# Altium project STM32F746 DEV BOARD_V1I1.PrjPcb (part 1 of 2)
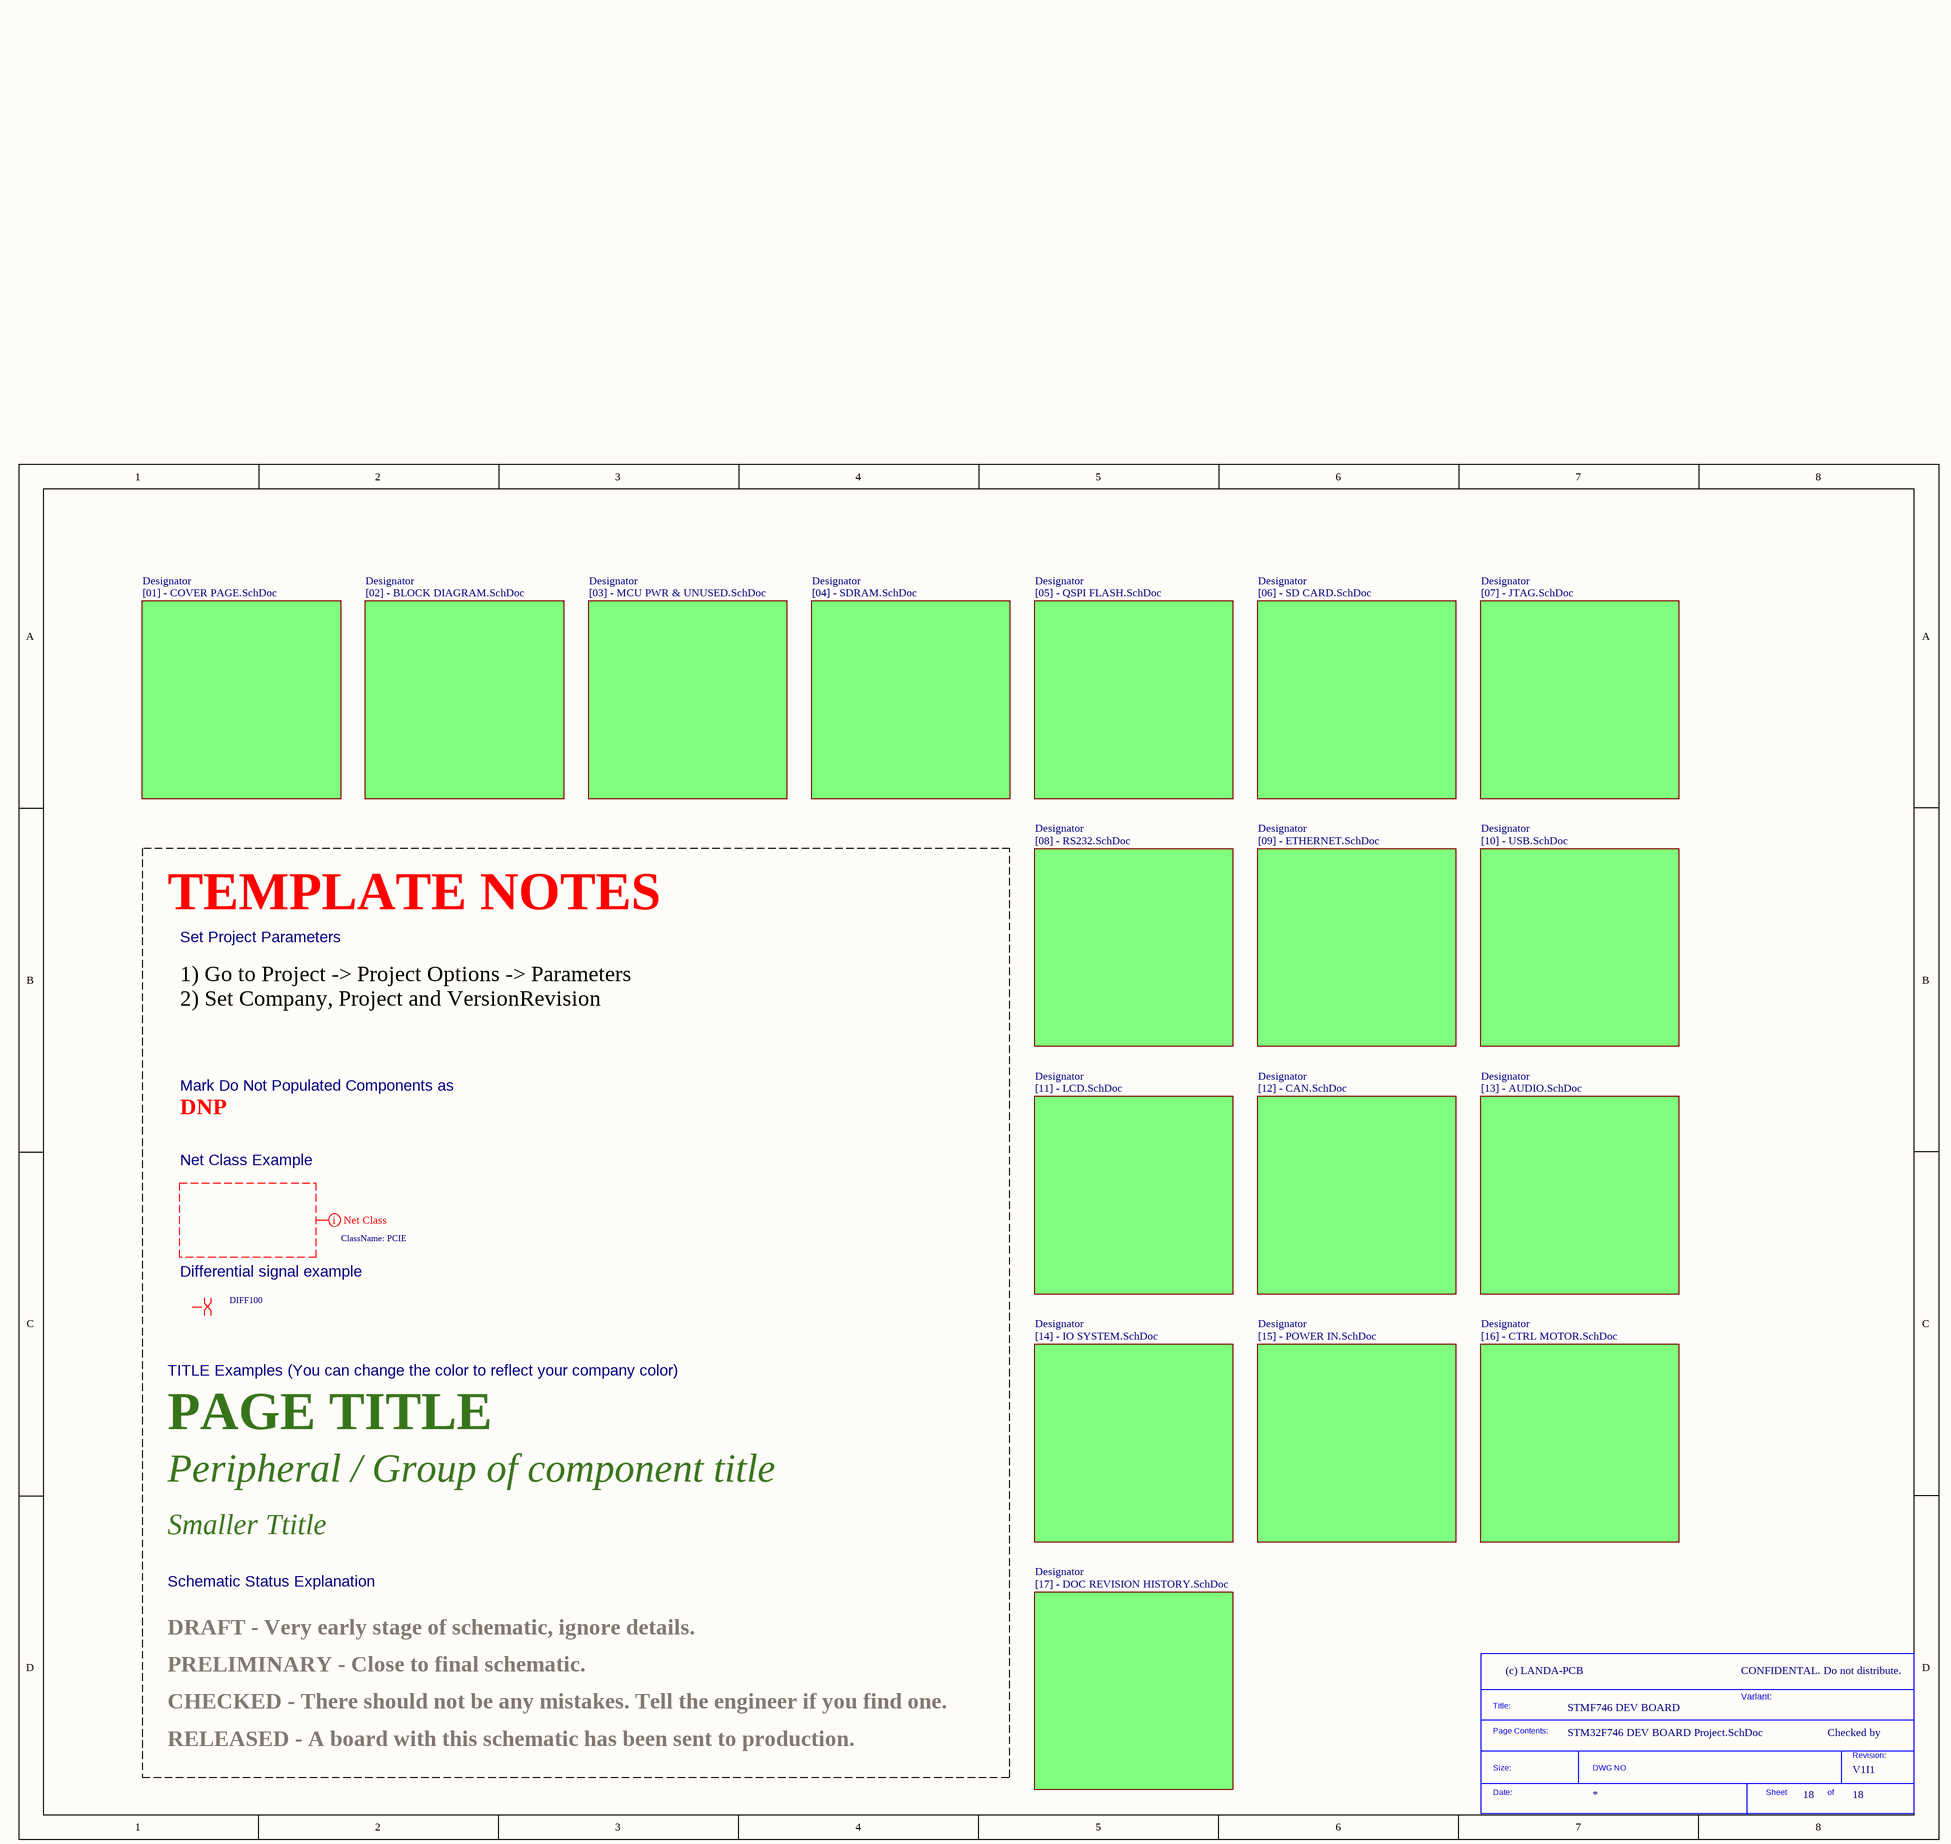
[diagram p0: STM32F746 DEV BOARD Project.SchDoc]
Company: (c) LANDA-PCB; Project: STMF746 DEV BOARD; VersionRevision: V1I1
18 sheets, 372 parts. Net scope: flat (ports and power ports of the same name join across sheets).
Sheets:
  STM32F746 DEV BOARD Project.SchDoc
    Designator = [01] - COVER PAGE.SchDoc
    Designator = [02] - BLOCK DIAGRAM.SchDoc
    Designator = [17] - DOC REVISION HISTORY.SchDoc
    Designator = [03] - MCU PWR & UNUSED.SchDoc
    Designator = [04] - SDRAM.SchDoc
    Designator = [05] - QSPI FLASH.SchDoc
    Designator = [06] - SD CARD.SchDoc
    Designator = [16] - CTRL MOTOR.SchDoc
    Designator = [07] - JTAG.SchDoc
    Designator = [08] - RS232.SchDoc
    Designator = [09] - ETHERNET.SchDoc
    Designator = [10] - USB.SchDoc
    Designator = [11] - LCD.SchDoc
    Designator = [12] - CAN.SchDoc
    Designator = [13] - AUDIO.SchDoc
    Designator = [14] - IO SYSTEM.SchDoc
    Designator = [15] - POWER IN.SchDoc

## Sheet STM32F746 DEV BOARD Project.SchDoc
size A3; CompanyName: KDS; Organization: KDS; DocumentNumber: 18; Revision: V1I1; SheetNumber: 18; SheetTotal: 18; PageSetup: Record=PageOptions|CenterHorizontal=True|CenterVertical=True|PrintScale=1.07|XCorrection=1.00|YCorrection=1.00|PrintKind=1|BorderSize=5000000|LeftOffset=0|BottomOffset=0|Orientation=2|PaperLength=1000|PaperWidth=1000|Scale=100|PaperSource=7|PrintQuality=600|MediaType=1|DitherType=10|PaperKind=A3|PrintScaleMode=1; ProjectName: KDS C6A816x Module

### Parts
(Parts that share a designator on the sheet are numbered #1, #2 ... from top to bottom, then left to right.)
*#1  SDTitleBlock  (value not drawn)  (graphical)

### Sub-sheets
Designator = [01] - COVER PAGE.SchDoc: no entries
Designator = [02] - BLOCK DIAGRAM.SchDoc: no entries
Designator = [17] - DOC REVISION HISTORY.SchDoc: no entries
Designator = [03] - MCU PWR & UNUSED.SchDoc: no entries
Designator = [04] - SDRAM.SchDoc: no entries
Designator = [05] - QSPI FLASH.SchDoc: no entries
Designator = [06] - SD CARD.SchDoc: no entries
Designator = [16] - CTRL MOTOR.SchDoc: no entries
Designator = [07] - JTAG.SchDoc: no entries
Designator = [08] - RS232.SchDoc: no entries
Designator = [09] - ETHERNET.SchDoc: no entries
Designator = [10] - USB.SchDoc: no entries
Designator = [11] - LCD.SchDoc: no entries
Designator = [12] - CAN.SchDoc: no entries
Designator = [13] - AUDIO.SchDoc: no entries
Designator = [14] - IO SYSTEM.SchDoc: no entries
Designator = [15] - POWER IN.SchDoc: no entries

### Layout directives
net class PCIE: (no net found under the mark)
differential pair; net class DIFF100: (no net found under the mark)

### Notes on the sheet
- TEMPLATE NOTES
- Set Project Parameters
- 1) Go to Project -> Project Options -> Parameters
  2) Set Company, Project and VersionRevision
- DNP
- Mark Do Not Populated Components as
- Net Class Example
- Differential signal example
- TITLE Examples (You can change the color to reflect your company color)
- PAGE TITLE
- Peripheral / Group of component title
- Smaller Ttitle
- Schematic Status Explanation
- PRELIMINARY - Close to final schematic.
- DRAFT - Very early stage of schematic, ignore details.
- CONFIDENTAL. Do not distribute.
- CHECKED - There should not be any mistakes. Tell the engineer if you find one.
- Variant:
- Checked by
- RELEASED - A board with this schematic has been sent to production.
- (in symbol SDTitleBlock) Title:; Page Contents:; Revision:; Size:; DWG NO; Date:; Sheet; of

## Sheet [01] - COVER PAGE.SchDoc
size A3; DocumentNumber: 1; SheetNumber: 1; SheetTotal: 18
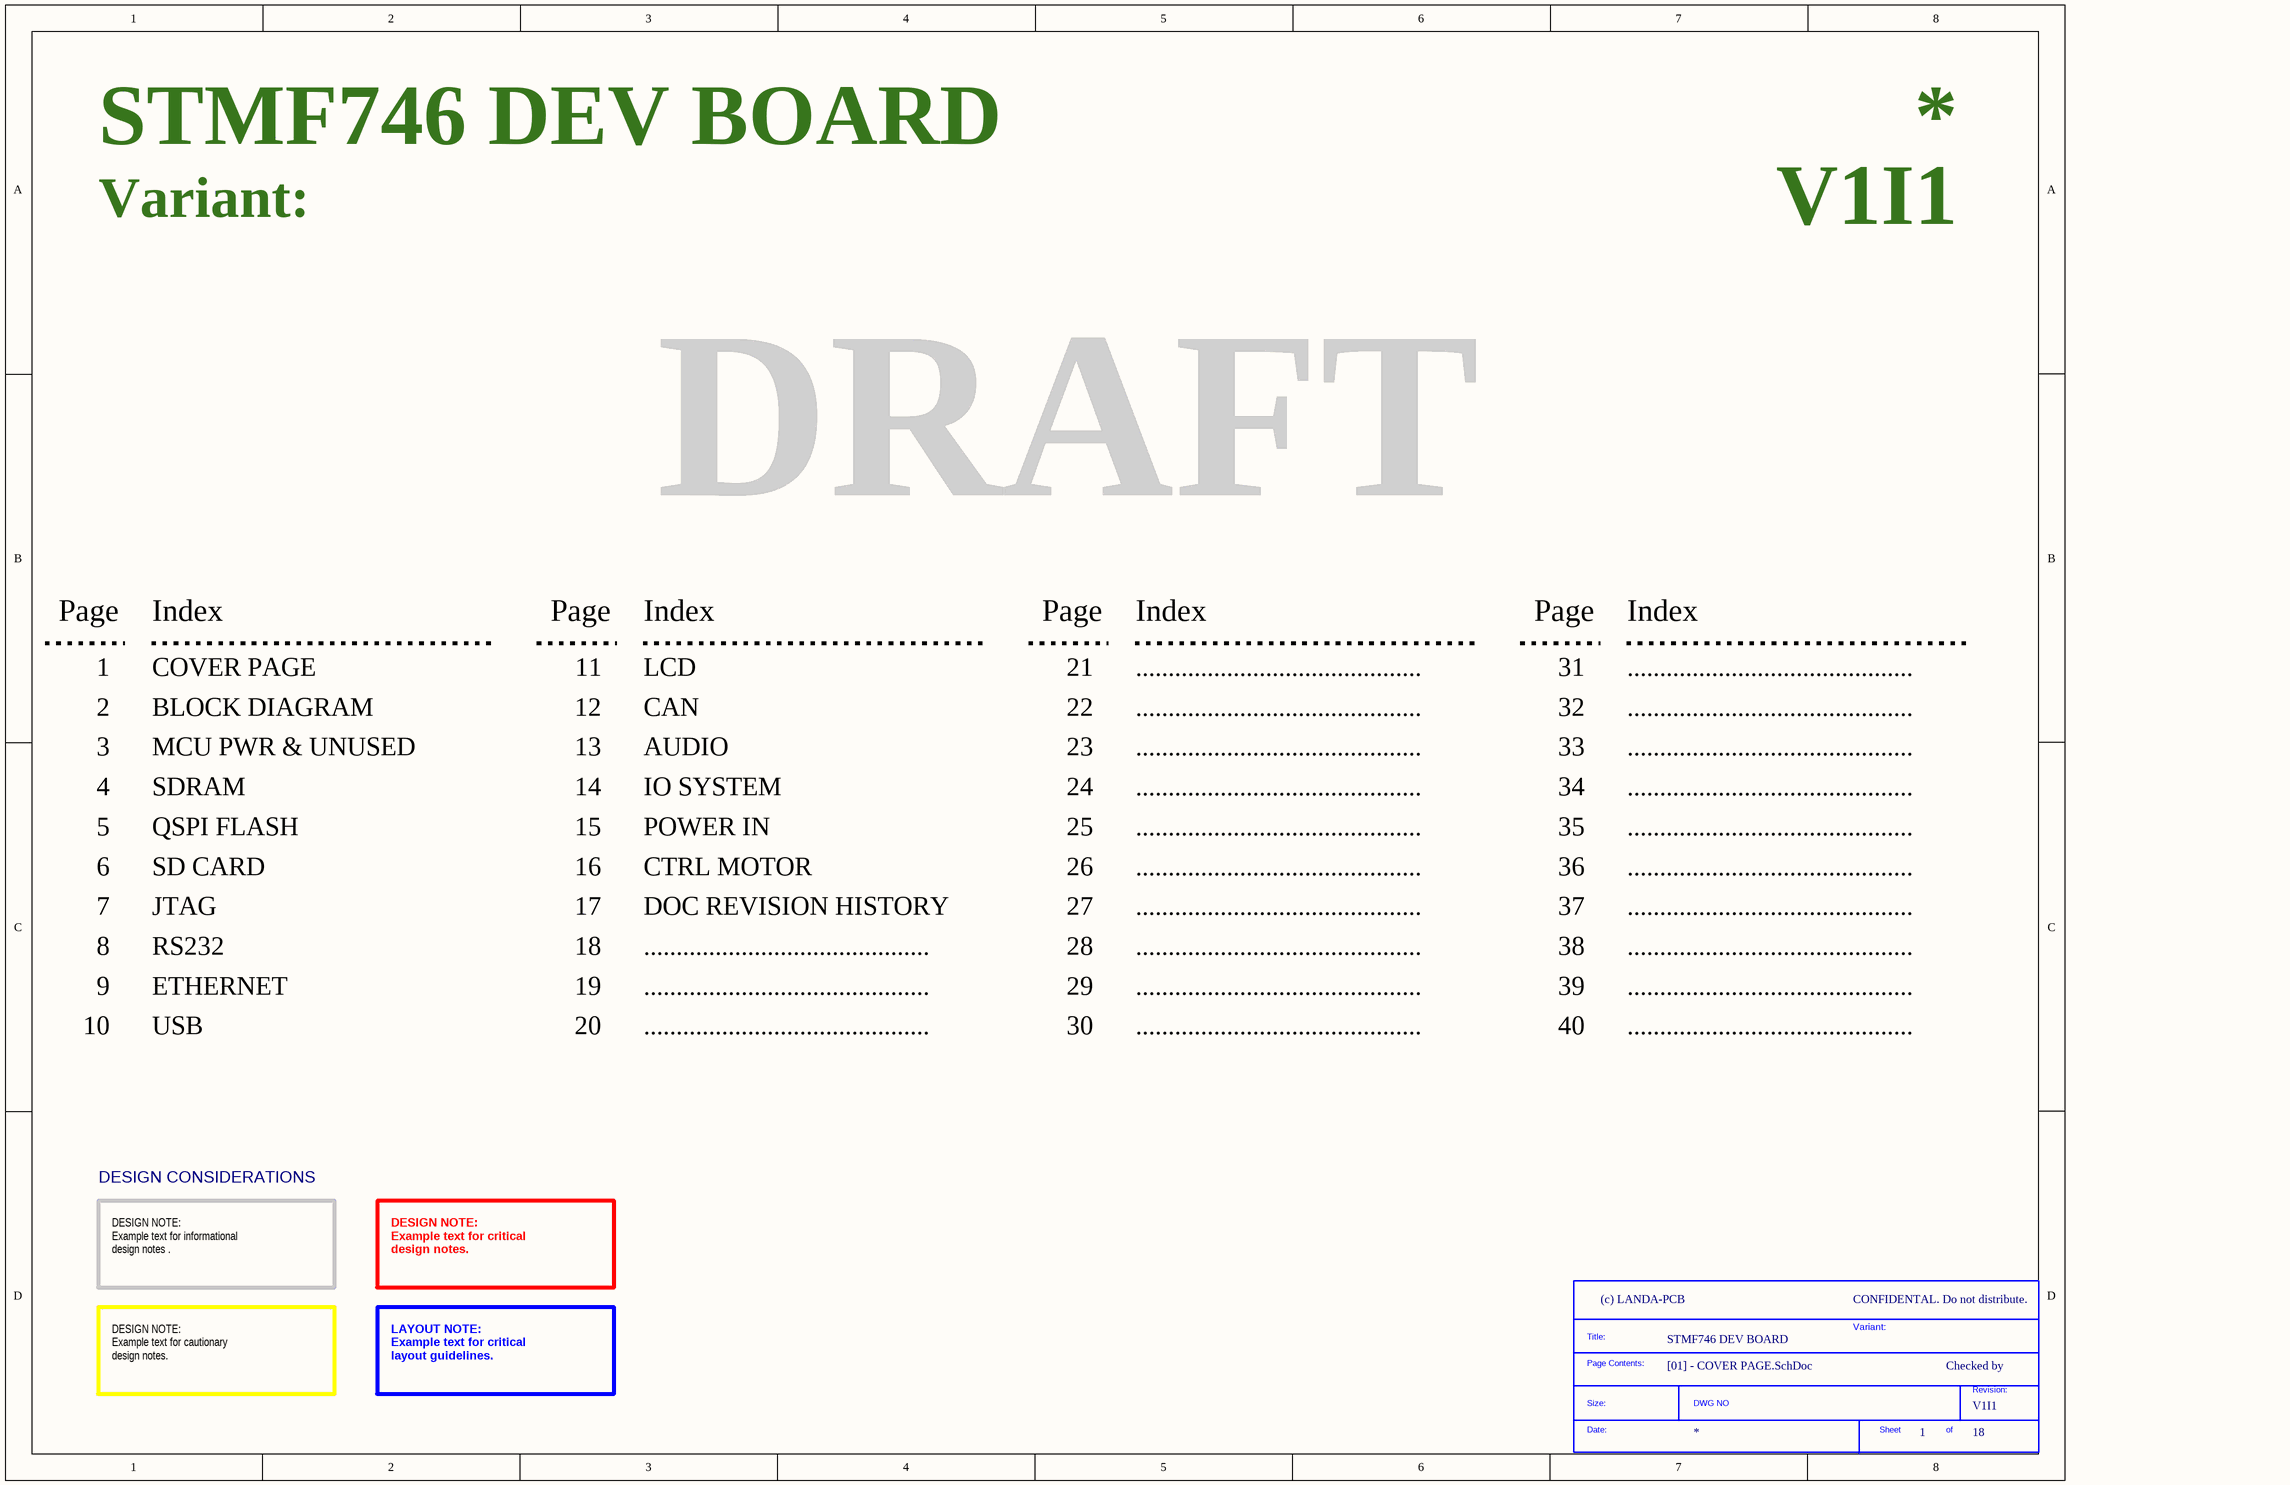
[diagram p1: [01] - COVER PAGE.SchDoc]

### Parts
(Parts that share a designator on the sheet are numbered #1, #2 ... from top to bottom, then left to right.)
*#2  SDTitleBlock  (value not drawn)  (graphical)

### Notes on the sheet
- Variant:
- DRAFT
- Page
- Index
- 1
- COVER PAGE
- 11
- LCD
- 21
- ............................................
- 31
- 2
- 3
- BLOCK DIAGRAM
- MCU PWR & UNUSED
- 12
- 13
- CAN
- AUDIO
- 22
- 23
- 32
- 33
- 4
- 5
- SDRAM
- QSPI FLASH
- 14
- 15
- IO SYSTEM
- POWER IN
- 24
- 25
- 34
- 35
- 6
- SD CARD
- 16
- CTRL MOTOR
- 26
- 36
- 7
- 8
- JTAG
- RS232
- 17
- 18
- DOC REVISION HISTORY
- 27
- 28
- 37
- 38
- 9
- 10
- ETHERNET
- USB
- 19
- 20
- 29
- 30
- 39
- 40
- DESIGN CONSIDERATIONS
- DESIGN NOTE:
  Example text for informational
  design notes .
- DESIGN NOTE:
  Example text for critical
  design notes.
- CONFIDENTAL. Do not distribute.
- Checked by
- DESIGN NOTE:
  Example text for cautionary
  design notes.
- LAYOUT NOTE:
  Example text for critical
  layout guidelines.
- (in symbol SDTitleBlock) Title:; Page Contents:; Revision:; Size:; DWG NO; Date:; Sheet; of

## Sheet [02] - BLOCK DIAGRAM.SchDoc
size A3; DocumentNumber: 2; SheetNumber: 2; SheetTotal: 18
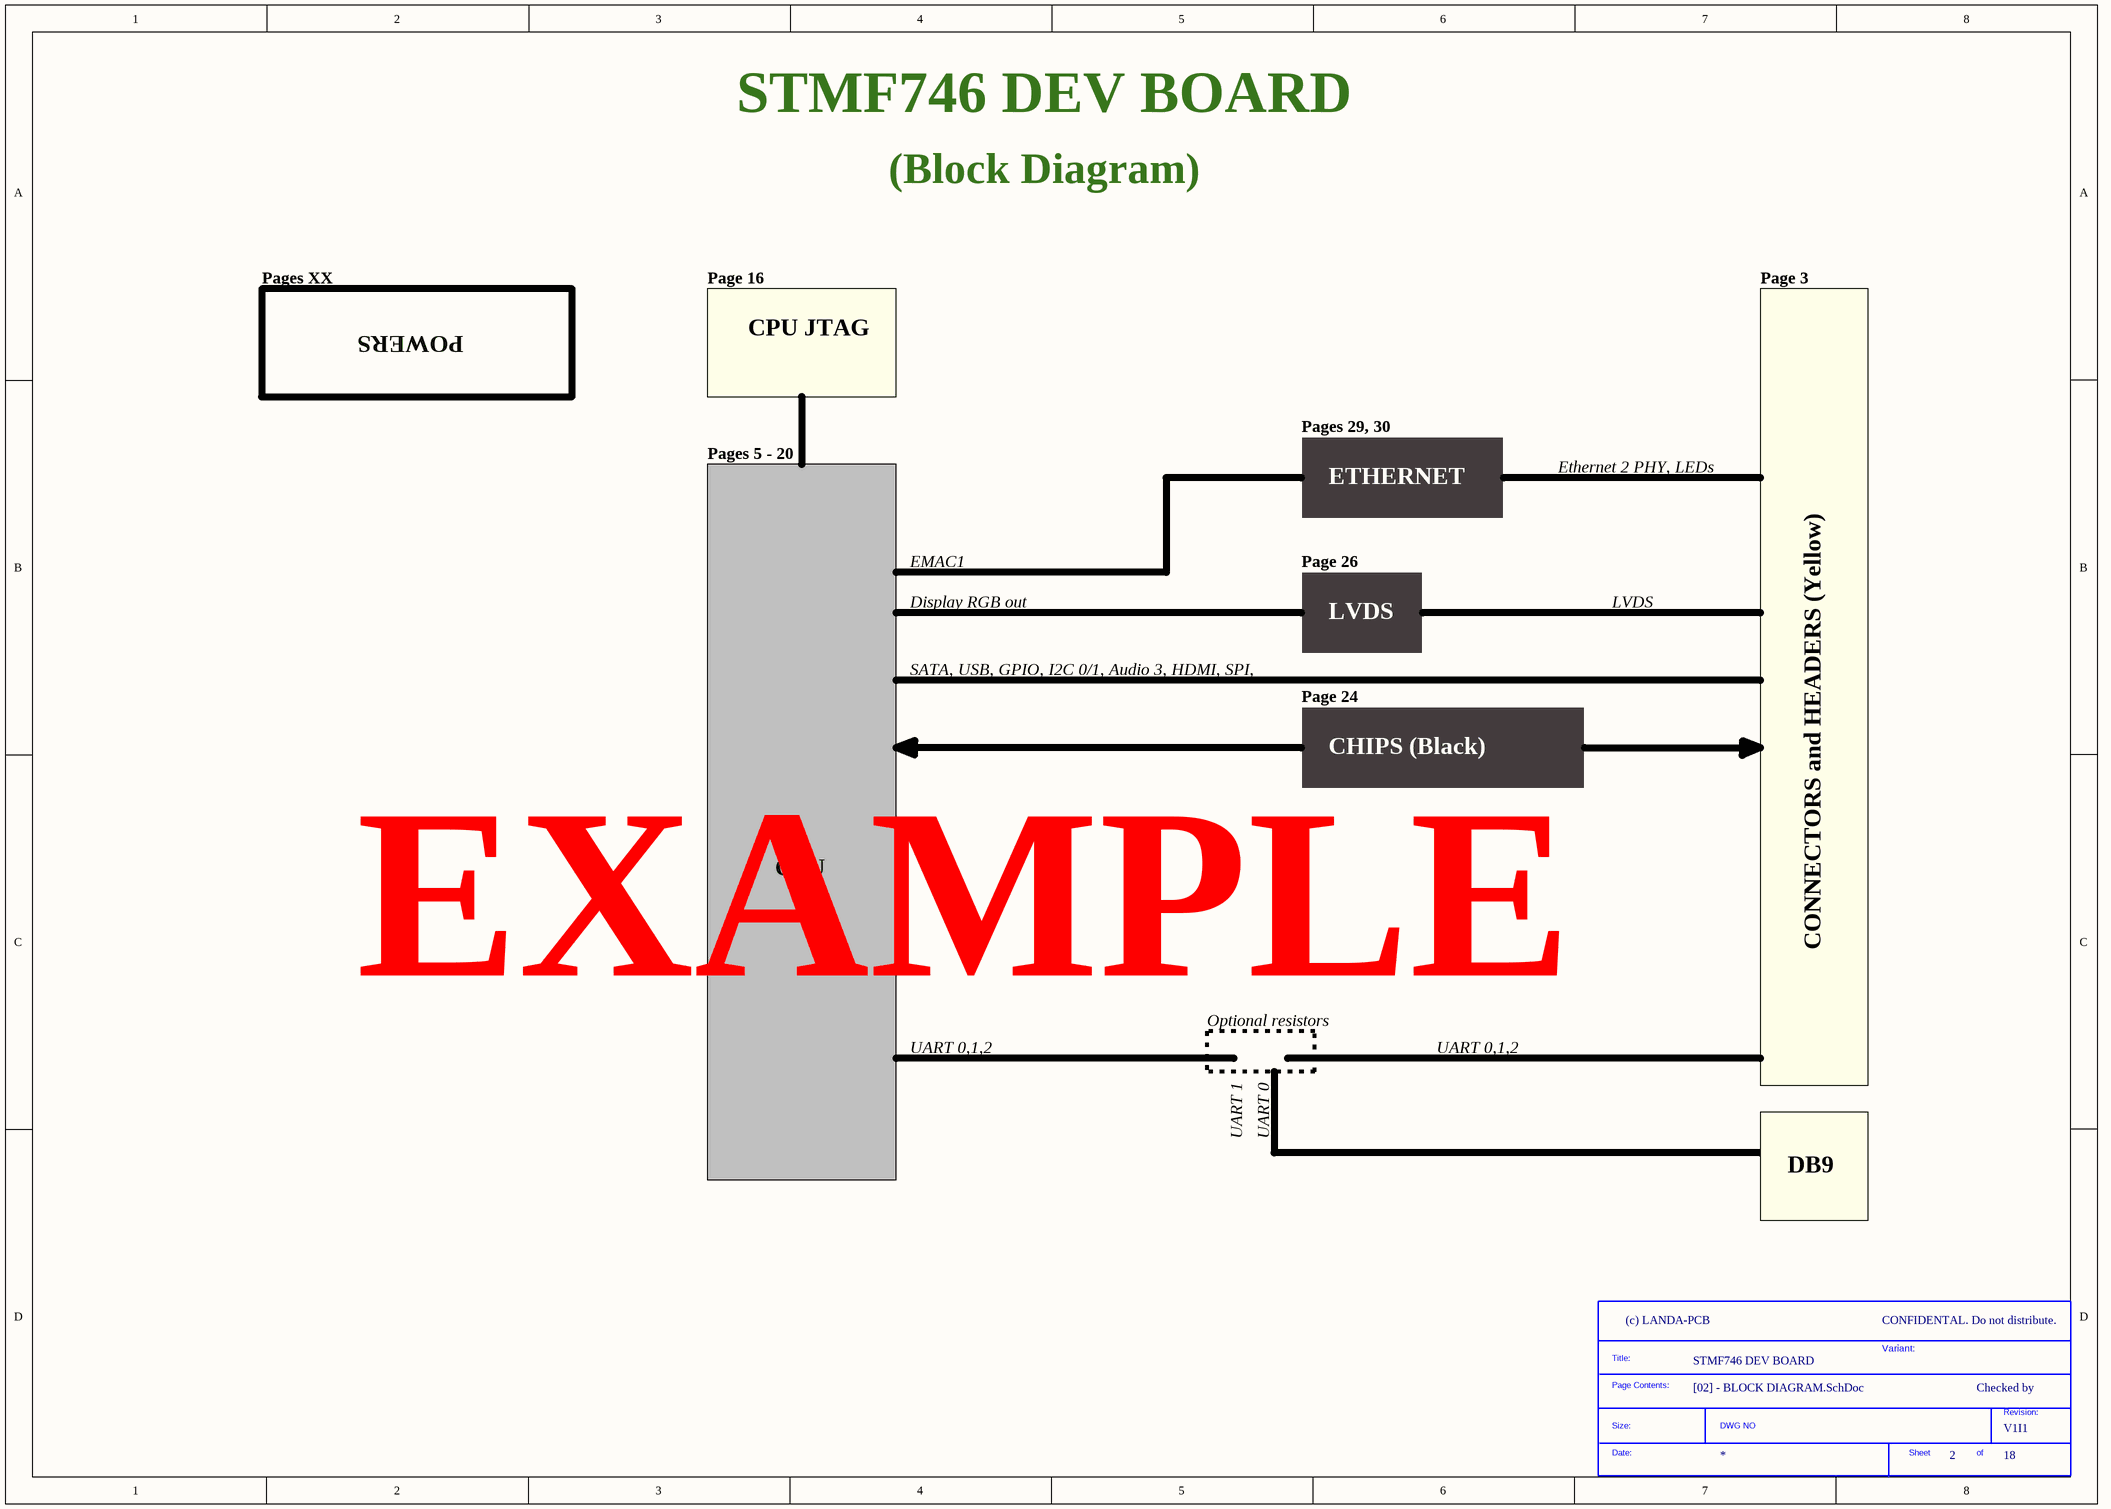
[diagram p2: [02] - BLOCK DIAGRAM.SchDoc]

### Parts
(Parts that share a designator on the sheet are numbered #1, #2 ... from top to bottom, then left to right.)
*#3  SDTitleBlock  (value not drawn)  (graphical)

### Notes on the sheet
- (Block Diagram)
- Pages XX
- Page 16
- Page 3
- POWERS
- CPU JTAG
- Pages 29, 30
- Pages 5 - 20
- ETHERNET
- Ethernet 2 PHY, LEDs
- EMAC1
- Page 26
- Display RGB out
- LVDS
- SATA, USB, GPIO, I2C 0/1, Audio 3, HDMI, SPI,
- Page 24
- CHIPS (Black)
- CPU
- CONNECTORS and HEADERS (Yellow)
- EXAMPLE
- UART 0,1,2
- Optional resistors
- FPGA
- UART 1
- UART 0
- DB9
- CONFIDENTAL. Do not distribute.
- CLOCKS (CPU & PCIE)
- Variant:
- Checked by
- (in symbol SDTitleBlock) Title:; Page Contents:; Revision:; Size:; DWG NO; Date:; Sheet; of

## Sheet [17] - DOC REVISION HISTORY.SchDoc
size A3; DocumentNumber: 17; SheetNumber: 17; SheetTotal: 18
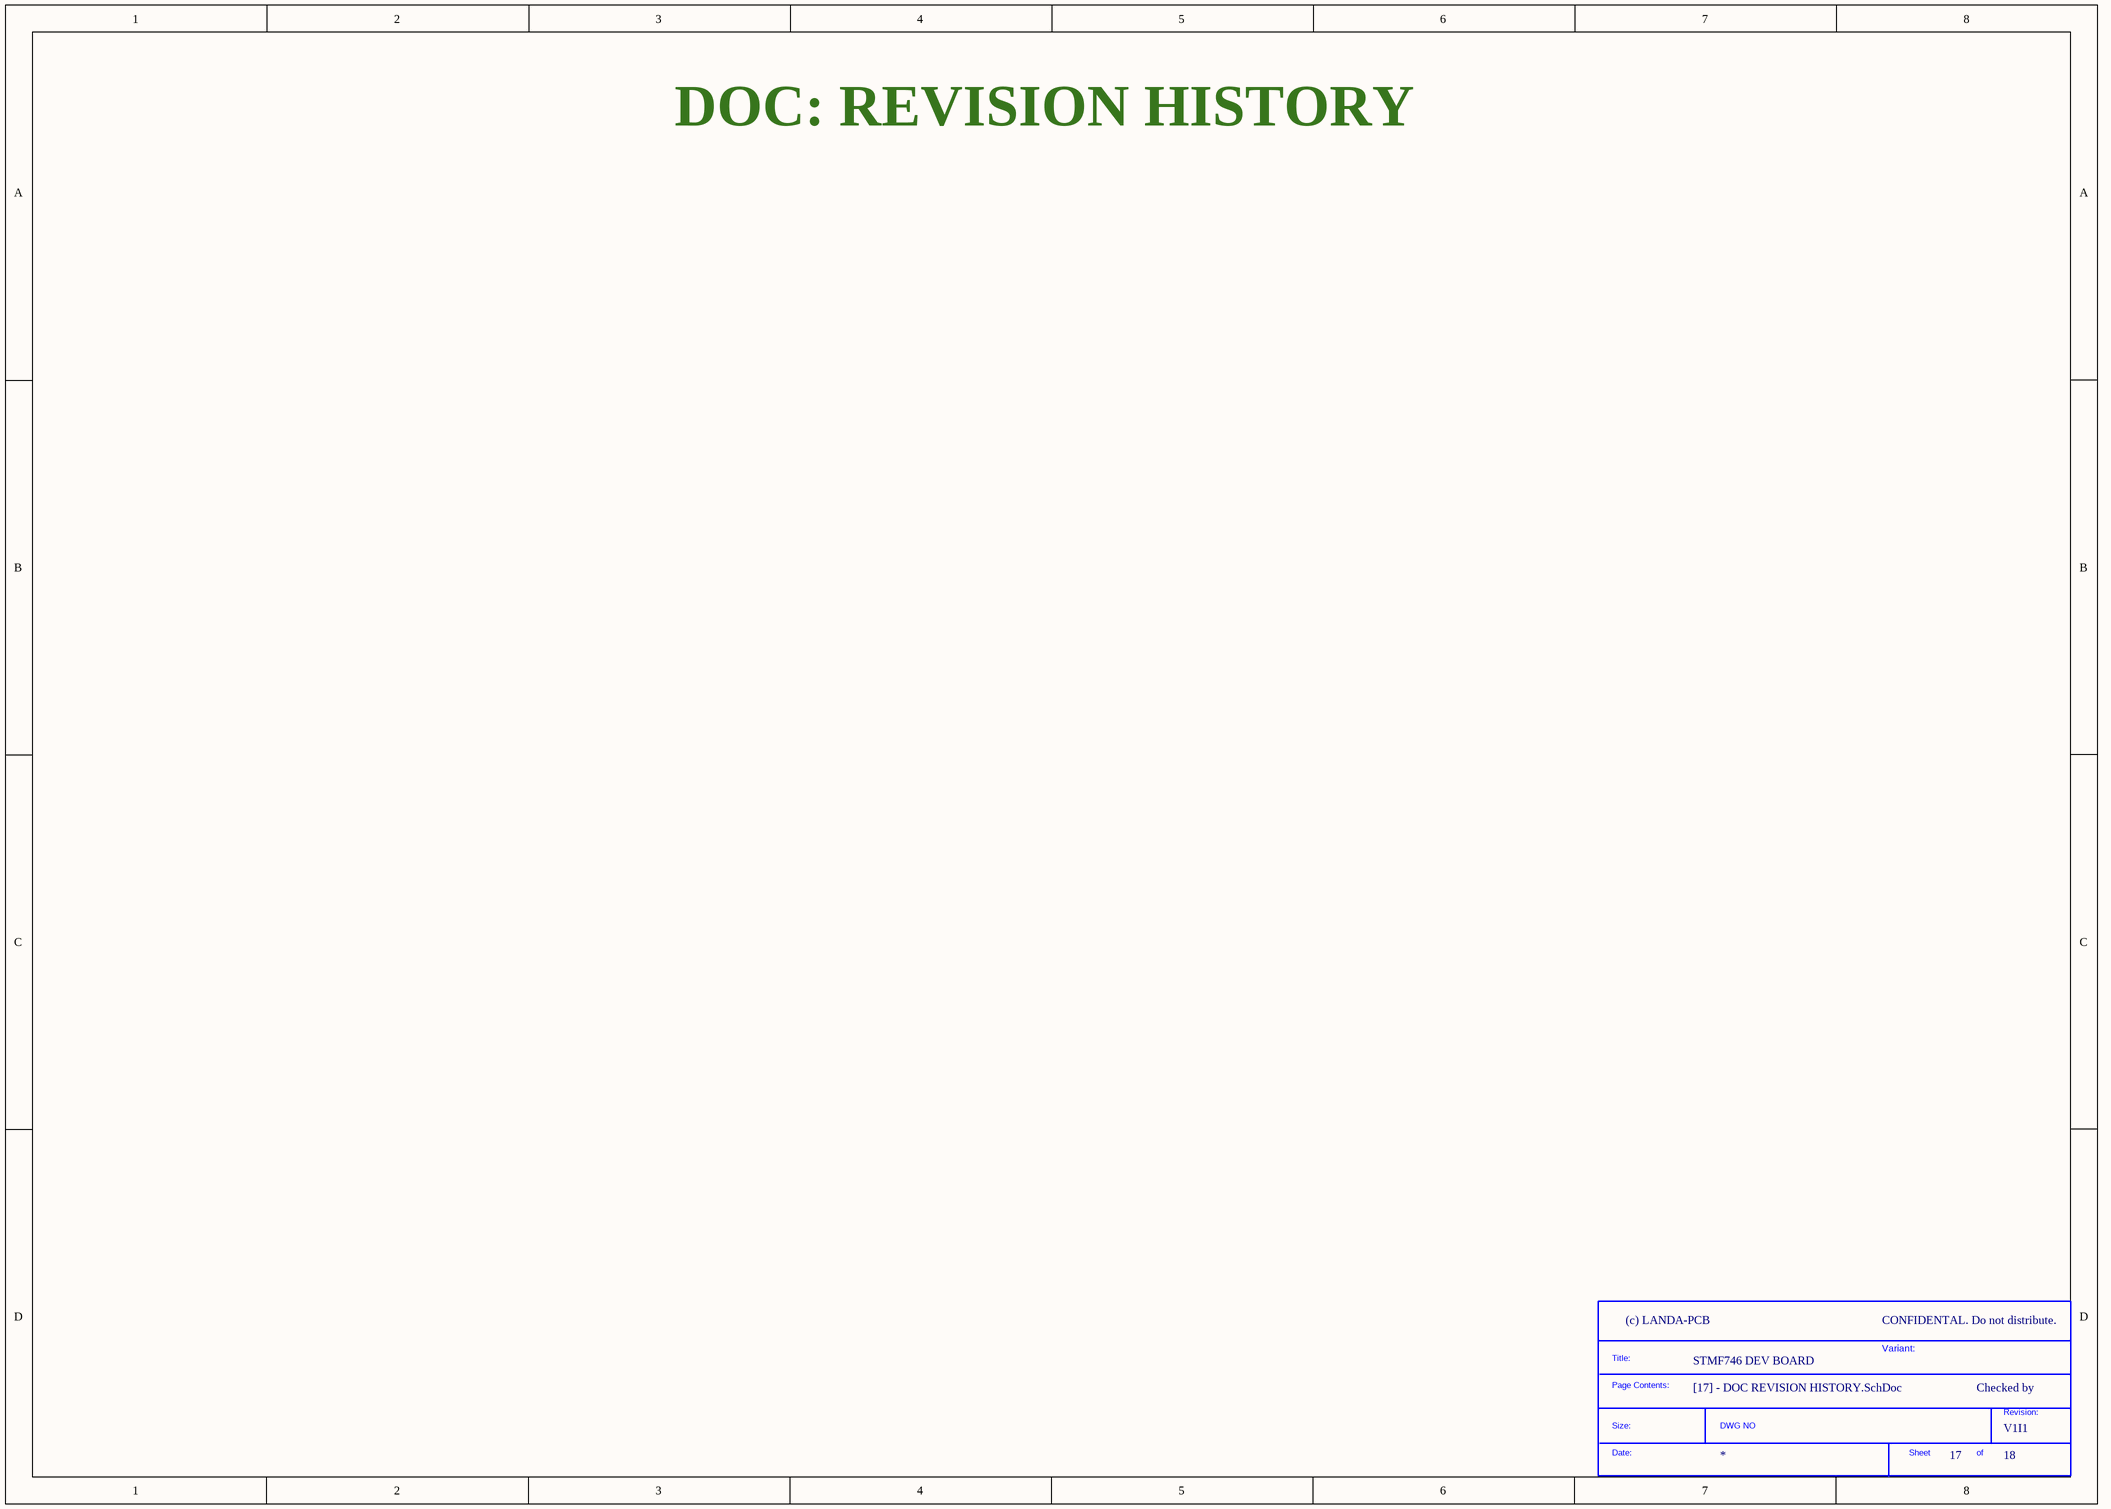
[diagram p3: [17] - DOC REVISION HISTORY.SchDoc]

### Parts
(Parts that share a designator on the sheet are numbered #1, #2 ... from top to bottom, then left to right.)
*#4  SDTitleBlock  (value not drawn)  (graphical)

### Notes on the sheet
- DOC: REVISION HISTORY
- CONFIDENTAL. Do not distribute.
- CLOCKS (CPU & PCIE)
- Variant:
- Checked by
- (in symbol SDTitleBlock) Title:; Page Contents:; Revision:; Size:; DWG NO; Date:; Sheet; of

## Sheet [03] - MCU PWR & UNUSED.SchDoc
size A3; DocumentNumber: 3; SheetNumber: 3; SheetTotal: 18
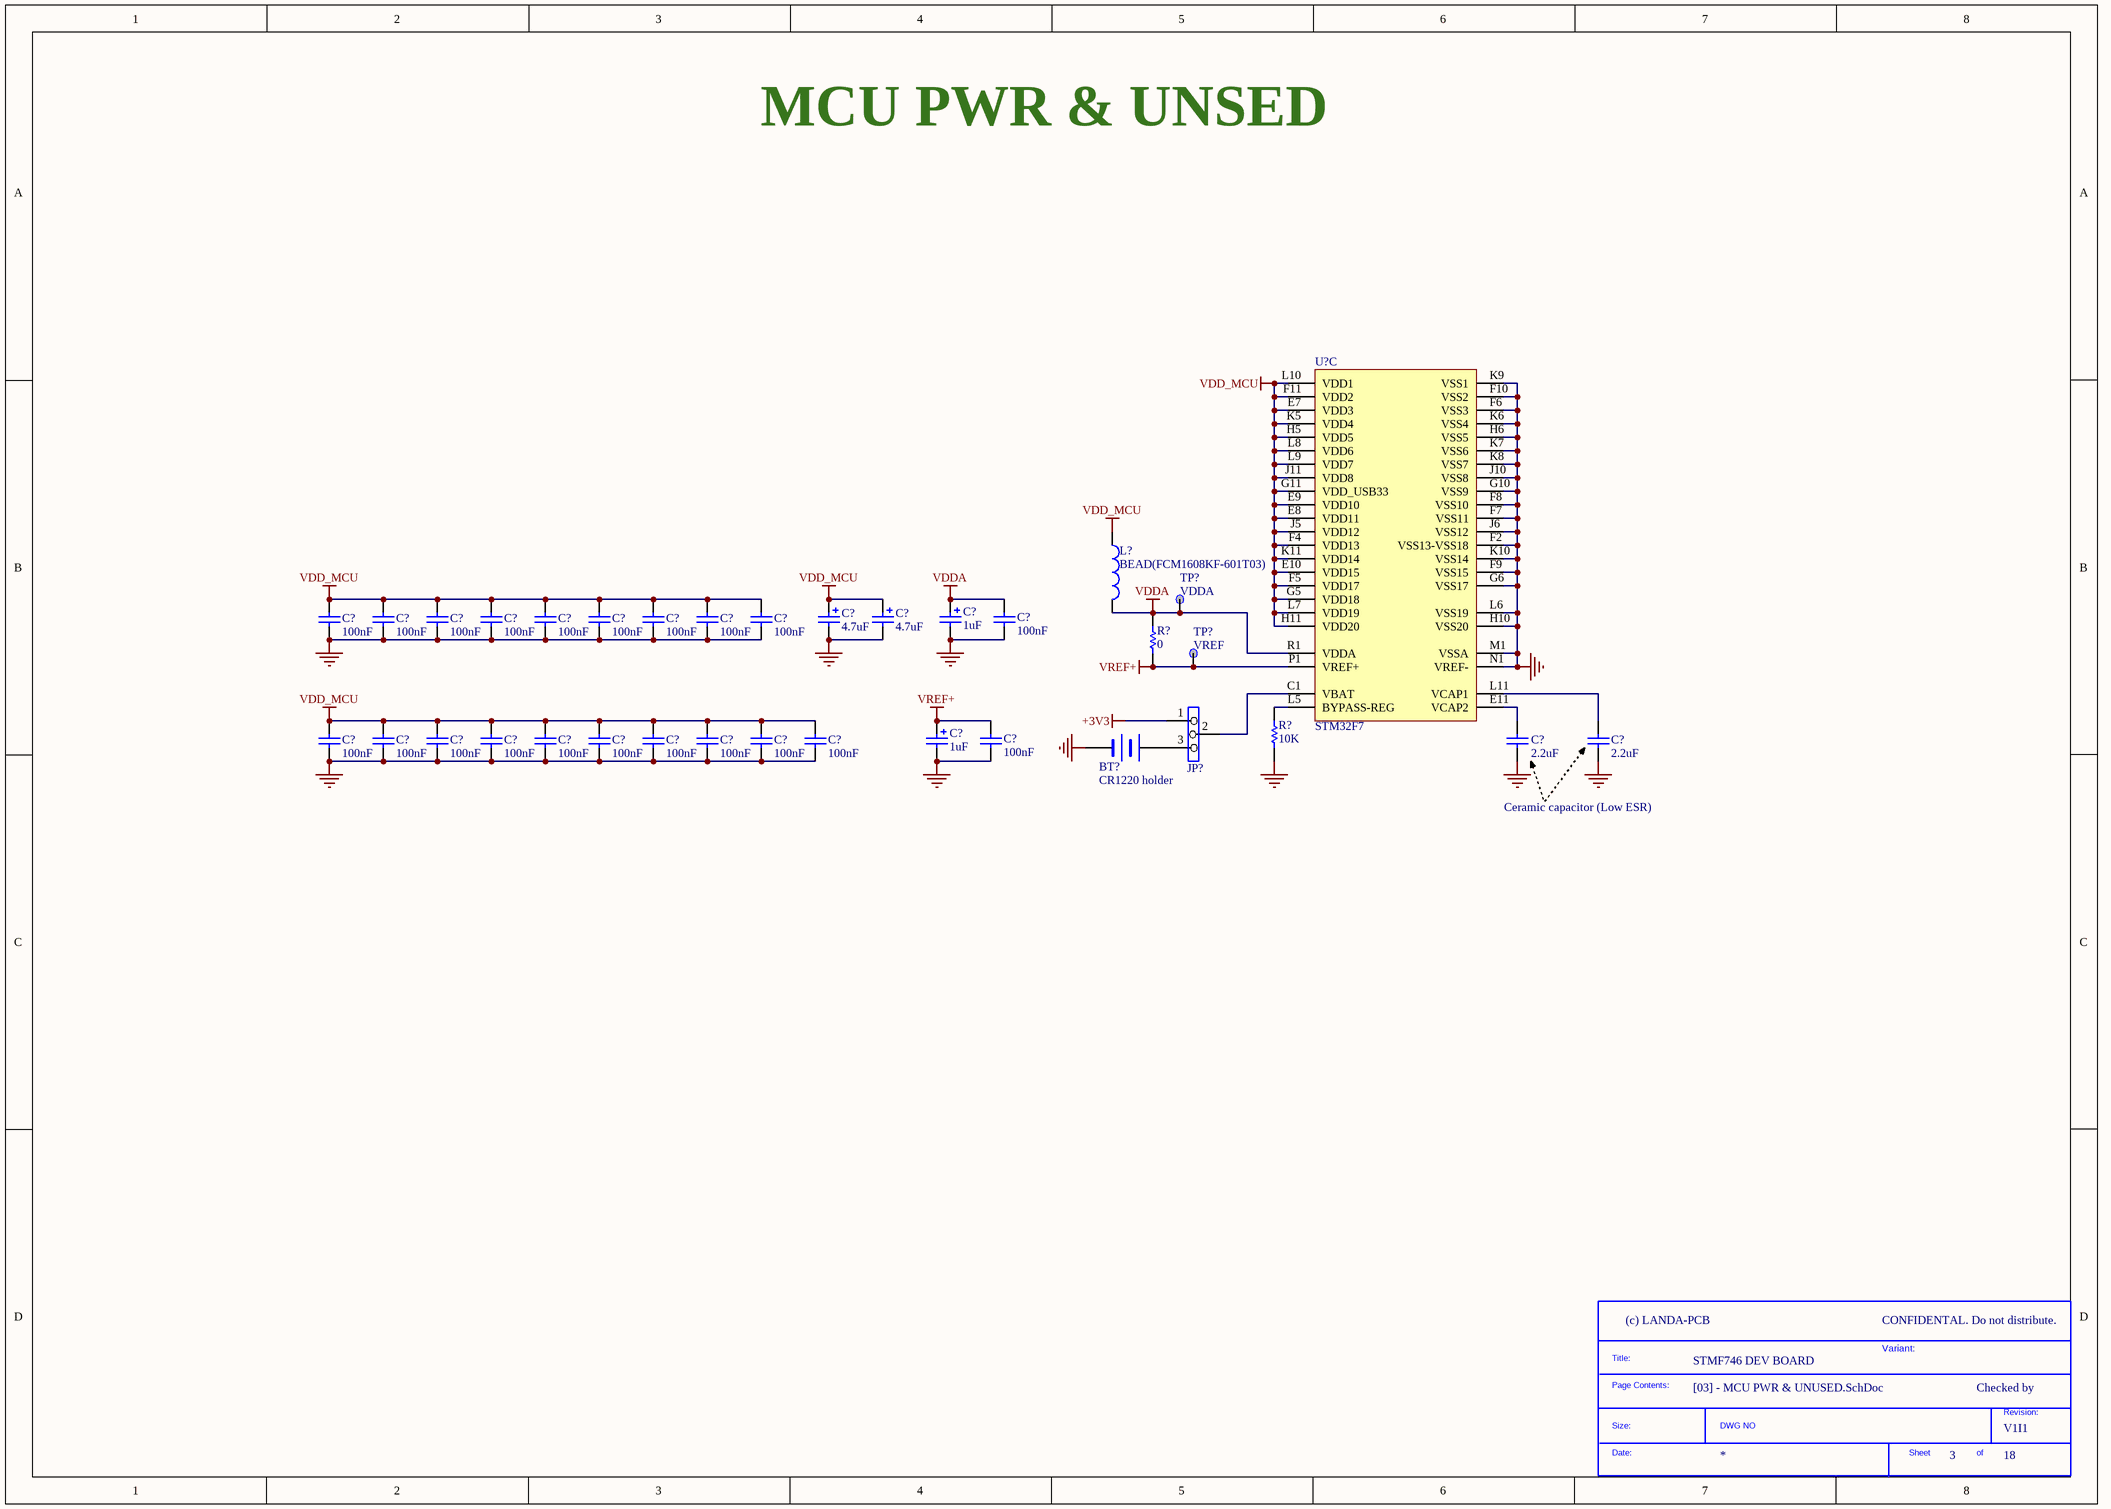
[diagram p4: [03] - MCU PWR & UNUSED.SchDoc]

### Parts
(Parts that share a designator on the sheet are numbered #1, #2 ... from top to bottom, then left to right.)
*#5  SDTitleBlock  (value not drawn)  (graphical)
BT?  CR1220 holder  [BAT_2SM_CR1220]
C?#1  100nF  [0402C]
C?#2  100nF  [0402C]
C?#3  100nF  [0402C]
C?#4  100nF  [0402C]
C?#5  100nF  [0402C]
C?#6  100nF  [0402C]
C?#7  100nF  [0402C]
C?#8  100nF  [0402C]
C?#9  100nF  [0402C]
C?#10  4.7uF  [TAN-A]
C?#11  4.7uF  [TAN-A]
C?#12  1uF  [TAN-A]
C?#13  100nF  [0402C]
C?#14  100nF  [0402C]
C?#15  100nF  [0402C]
C?#16  100nF  [0402C]
C?#17  100nF  [0402C]
C?#18  100nF  [0402C]
C?#19  100nF  [0402C]
C?#20  100nF  [0402C]
C?#21  100nF  [0402C]
C?#22  100nF  [0402C]
C?#23  100nF  [0402C]
C?#24  1uF  [TAN-A]
C?#25  2.2uF  [1206C]
C?#26  2.2uF  [1206C]
C?#27  100nF  [0402C]
JP?#1  (no value)  [SIP3]
L?#1  BEAD(FCM1608KF-601T03)  [0603L]
R?#1  0  [0603R]
R?#2  10K  [0603R]
TP?#1  VDDA  [TP]
TP?#2  VREF  [TP]
U?#1  STM32F7  [BGA216_0R8_13X13_SKT]  (part C of 3)

### Nets
+3V3: JP?#1.1
GND: BT?.2(-) C?#1.2 C?#2.2 C?#3.2 C?#4.2 C?#5.2 C?#6.2 C?#7.2 C?#8.2 C?#9.2 C?#10.2 C?#11.2 C?#12.2 C?#13.1 C?#14.2 C?#15.2 C?#16.2 C?#17.2 C?#18.2 C?#19.2 C?#20.2 C?#21.2 C?#22.2 C?#23.2 C?#24.2 C?#25.2 C?#26.2 C?#27.1 R?#2.1 U?#1.F2(VSS13-VSS18) U?#1.F6(VSS3) U?#1.F7(VSS11) U?#1.F8(VSS10) U?#1.F9(VSS15) U?#1.F10(VSS2) U?#1.G6(VSS17) U?#1.G10(VSS9) U?#1.H6(VSS5) U?#1.H10(VSS20) U?#1.J6(VSS12) U?#1.J10(VSS8) U?#1.K6(VSS4) U?#1.K7(VSS6) U?#1.K8(VSS7) U?#1.K9(VSS1) U?#1.K10(VSS14) U?#1.L6(VSS19) U?#1.M1(VSSA) U?#1.N1(VREF-)
VDD_MCU: C?#1.1 C?#2.1 C?#3.1 C?#4.1 C?#5.1 C?#6.1 C?#7.1 C?#8.1 C?#9.1 C?#10.1 C?#11.1 C?#14.1 C?#15.1 C?#16.1 C?#17.1 C?#18.1 C?#19.1 C?#20.1 C?#21.1 C?#22.1 C?#23.1 L?#1.1 U?#1.E7(VDD3) U?#1.E8(VDD11) U?#1.E9(VDD10) U?#1.E10(VDD15) U?#1.F4(VDD13) U?#1.F5(VDD17) U?#1.F11(VDD2) U?#1.G5(VDD18) U?#1.G11(VDD_USB33) U?#1.H5(VDD5) U?#1.H11(VDD20) U?#1.J5(VDD12) U?#1.J11(VDD8) U?#1.K5(VDD4) U?#1.K11(VDD14) U?#1.L7(VDD19) U?#1.L8(VDD6) U?#1.L9(VDD7) U?#1.L10(VDD1)
VDDA: C?#12.1 C?#13.2 L?#1.2 R?#1.1 TP?#1.1 U?#1.R1(VDDA)
VREF+: C?#24.1 C?#27.2 R?#1.2 TP?#2.1 U?#1.P1(VREF+)
NetBT?_1: BT?.1(+) JP?#1.3
NetC?#25_1: C?#25.1 U?#1.E11(VCAP2)
NetC?#26_1: C?#26.1 U?#1.L11(VCAP1)
NetJP?#1_2: JP?#1.2 U?#1.C1(VBAT)
NetR?#2_2: R?#2.2 U?#1.L5(BYPASS-REG)

### Notes on the sheet
- MCU PWR & UNSED
- Ceramic capacitor (Low ESR)
- CONFIDENTAL. Do not distribute.
- CLOCKS (CPU & PCIE)
- Variant:
- Checked by
- (in symbol SDTitleBlock) Title:; Page Contents:; Revision:; Size:; DWG NO; Date:; Sheet; of

### Library data of the parts
BT? = BATTERY
C?#1-C?#9 C?#14-C?#23 = CAP: Capacitor; Published: 8-Jun-2000; Revision: July-2002: Re-released for DXP Platform.; Publisher: Altium Limited; Value: 100nF
C?#10 C?#11 = Cap Pol1: Polarized Capacitor (Radial); Value: 47uF; Published: 8-Jun-2000; Revision: July-2002: Re-released for DXP Platform.; Publisher: Altium Limited
C?#12 C?#24 = Cap Pol1: Polarized Capacitor (Radial); Value: 10uF; Published: 8-Jun-2000; Revision: July-2002: Re-released for DXP Platform.; Publisher: Altium Limited
C?#13 C?#25-C?#27 = Cap: Capacitor; Value: 10nF; Published: 8-Jun-2000; Revision: July-2002: Re-released for DXP Platform.; Publisher: Altium Limited
JP?#1 = Jumper3
L?#1 = Inductor: Value: 100uH; Published: 8-Jun-2000; Revision: July-2002: Re-released for DXP Platform.; Publisher: Altium Limited
R?#1 R?#2 = Res1: Resistor; Value: 1K; Published: 8-Jun-2000; Revision: July-2002: Re-released for DXP Platform.; Publisher: Altium Limited
TP?#1 TP?#2 = TP
U?#1 = STM32F7_TFBGA216

## Sheet [04] - SDRAM.SchDoc
size A3; DocumentNumber: 4; SheetNumber: 4; SheetTotal: 18
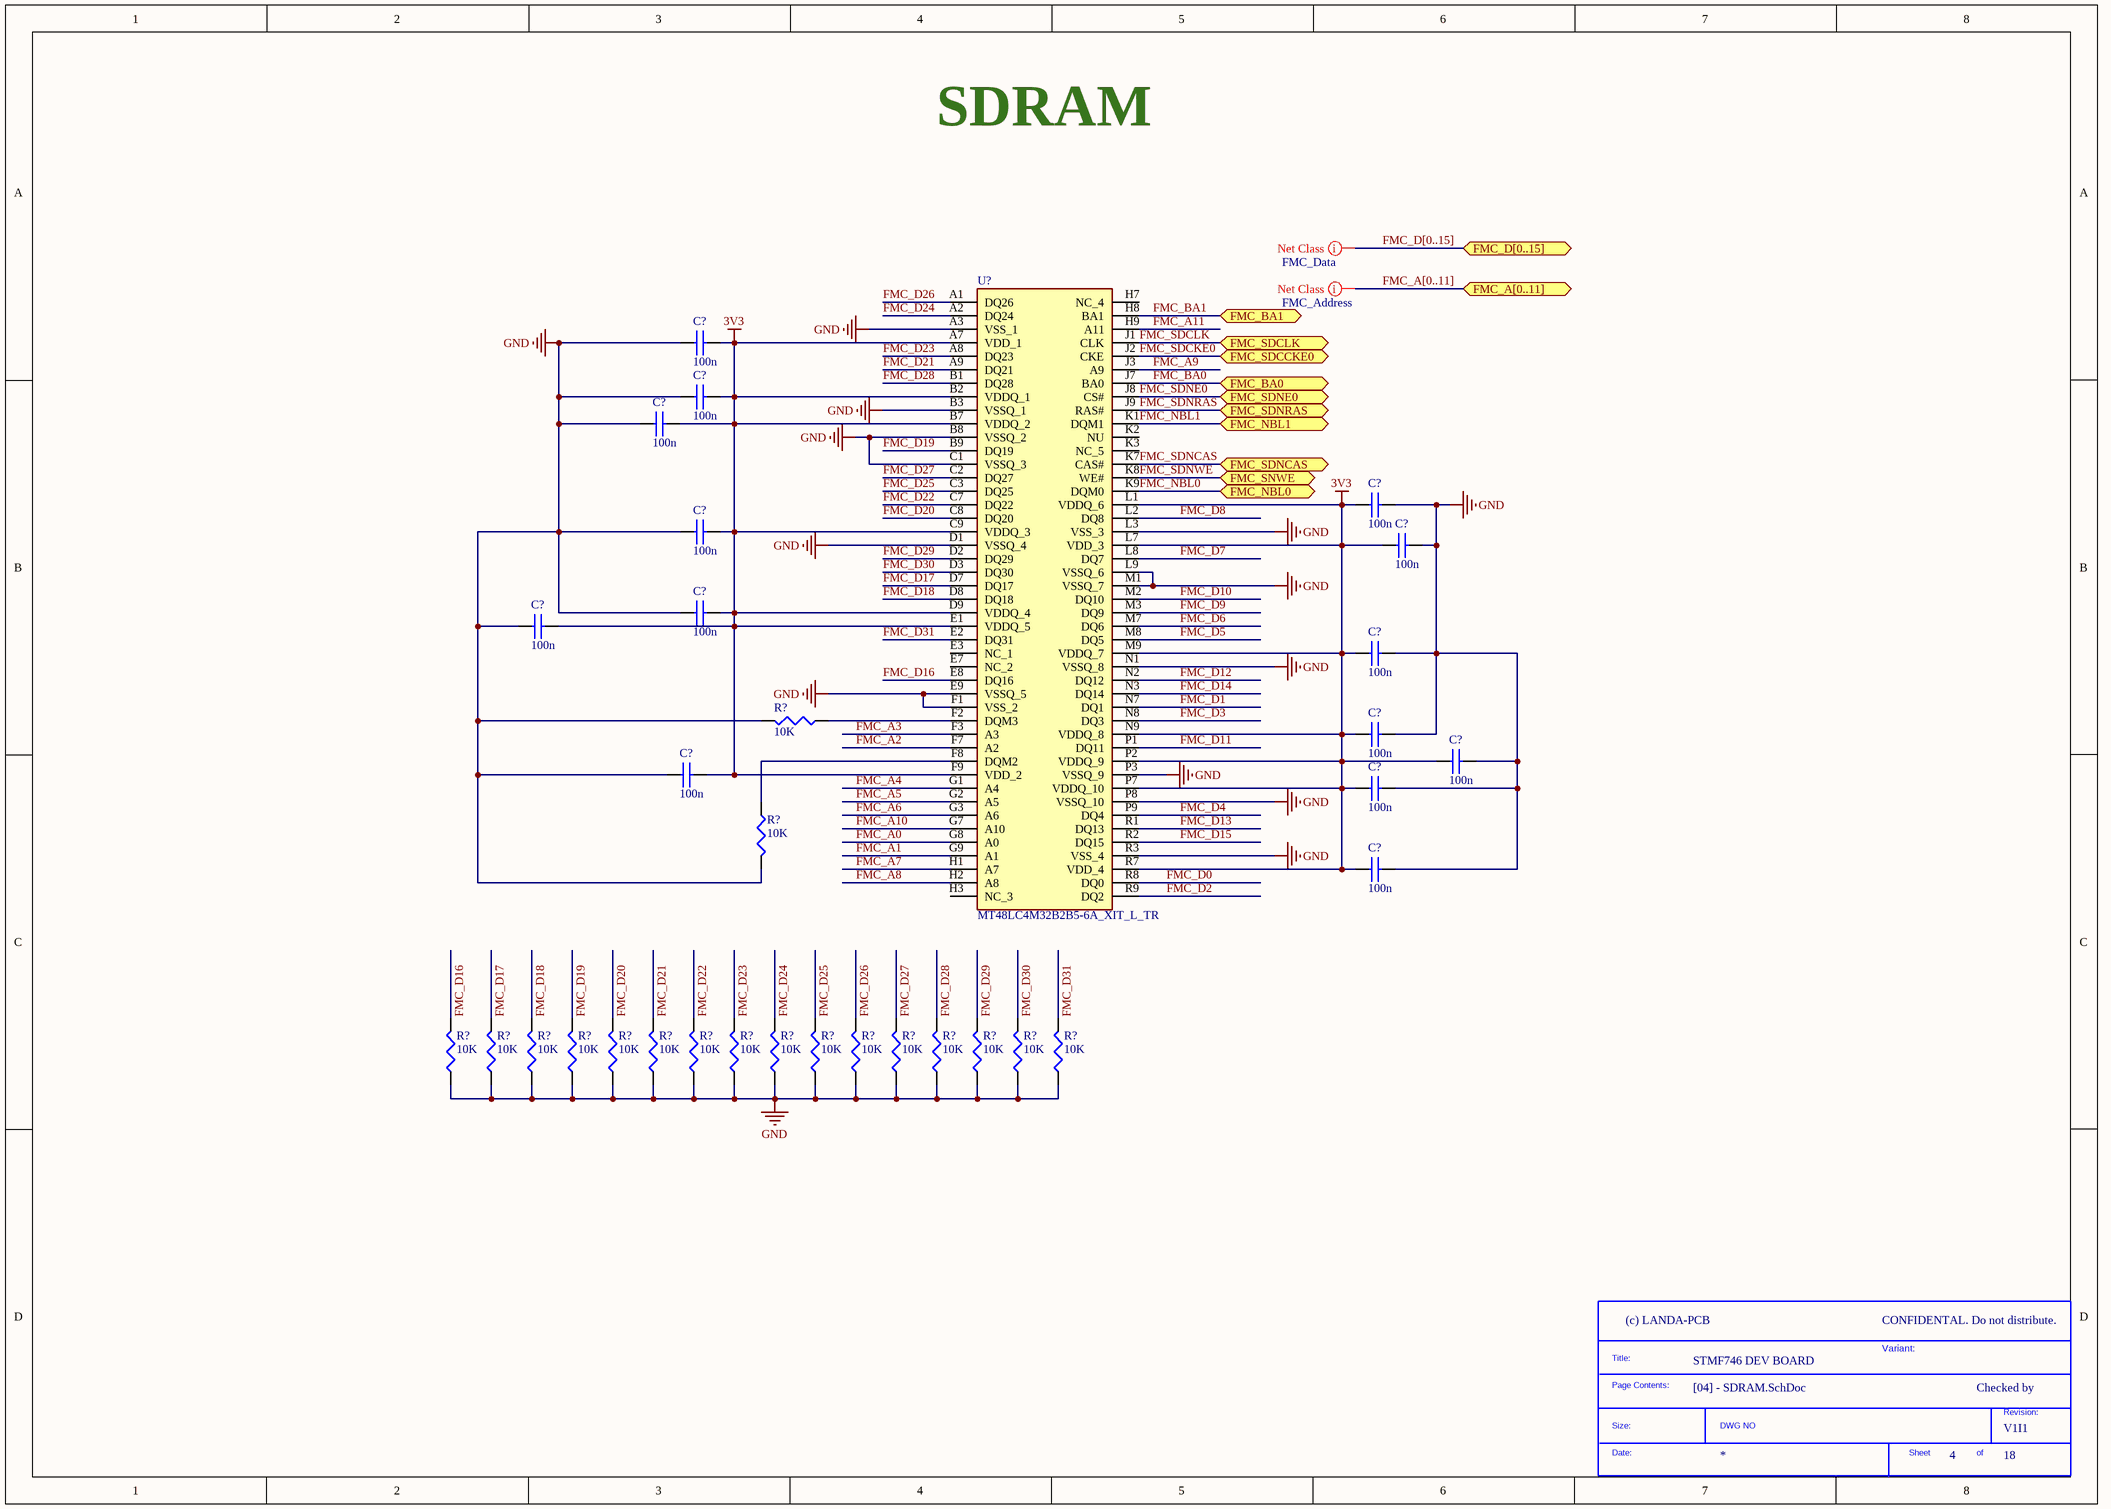
[diagram p5: [04] - SDRAM.SchDoc]

### Parts
(Parts that share a designator on the sheet are numbered #1, #2 ... from top to bottom, then left to right.)
*#6  SDTitleBlock  (value not drawn)  (graphical)
C?#28  100n  [C0402]
C?#29  100n  [C0402]
C?#30  100n  [C0402]
C?#31  100n  [C0402]
C?#32  100n  [C0402]
C?#33  100n  [C0402]
C?#34  100n  [C0402]
C?#35  100n  [C0402]
C?#36  100n  [C0402]
C?#37  100n  [C0402]
C?#38  100n  [C0402]
C?#39  100n  [C0402]
C?#40  100n  [C0402]
C?#41  100n  [C0402]
R?#3  10K  [R0402]
R?#4  10K  [R0402]
R?#5  10K  [R0402]
R?#6  10K  [R0402]
R?#7  10K  [R0402]
R?#8  10K  [R0402]
R?#9  10K  [R0402]
R?#10  10K  [R0402]
R?#11  10K  [R0402]
R?#12  10K  [R0402]
R?#13  10K  [R0402]
R?#14  10K  [R0402]
R?#15  10K  [R0402]
R?#16  10K  [R0402]
R?#17  10K  [R0402]
R?#18  10K  [R0402]
R?#19  10K  [R0402]
R?#20  10K  [R0402]
U?#2  MT48LC4M32B2B5-6A_XIT_L_TR  [BGA90C80P9X15_800X1300X70]

### Ports
FMC_A[0..11] (bidir), FMC_BA0 (bidir), FMC_BA1 (bidir), FMC_D[0..15] (bidir), FMC_NBL0 (bidir), FMC_NBL1 (bidir), FMC_SDCCKE0 (bidir), FMC_SDCLK (bidir), FMC_SDNCAS (bidir), FMC_SDNE0 (bidir), FMC_SDNRAS (bidir), FMC_SNWE (bidir)

### Nets
3V3: C?#28.2 C?#29.2 C?#30.2 C?#31.1 C?#32.2 C?#33.1 C?#34.2 C?#35.2 C?#36.1 C?#37.1 C?#38.1 C?#39.2 C?#40.1 C?#41.1 U?#2.A7(VDD_1) U?#2.B2(VDDQ_1) U?#2.B7(VDDQ_2) U?#2.C9(VDDQ_3) U?#2.D9(VDDQ_4) U?#2.E1(VDDQ_5) U?#2.F9(VDD_2) U?#2.L1(VDDQ_6) U?#2.L7(VDD_3) U?#2.M9(VDDQ_7) U?#2.N9(VDDQ_8) U?#2.P2(VDDQ_9) U?#2.P7(VDDQ_10) U?#2.R7(VDD_4)  [project net 3V3_uSD]
GND: C?#28.1 C?#29.1 C?#30.1 C?#31.2 C?#32.1 C?#33.2 C?#34.1 C?#35.1 C?#36.2 C?#37.2 C?#38.2 C?#39.1 C?#40.2 C?#41.2 R?#3.2 R?#4.2 R?#5.1 R?#6.1 R?#7.1 R?#8.1 R?#9.1 R?#10.1 R?#11.1 R?#12.1 R?#13.1 R?#14.1 R?#15.1 R?#16.1 R?#17.1 R?#18.1 R?#19.1 R?#20.1 U?#2.A3(VSS_1) U?#2.B3(VSSQ_1) U?#2.B8(VSSQ_2) U?#2.C1(VSSQ_3) U?#2.D1(VSSQ_4) U?#2.E9(VSSQ_5) U?#2.F1(VSS_2) U?#2.L3(VSS_3) U?#2.L9(VSSQ_6) U?#2.M1(VSSQ_7) U?#2.N1(VSSQ_8) U?#2.P3(VSSQ_9) U?#2.P8(VSSQ_10) U?#2.R3(VSS_4)
FMC_A0: U?#2.G8(A0)
FMC_A1: U?#2.G9(A1)
FMC_A2: U?#2.F7(A2)
FMC_A3: U?#2.F3(A3)
FMC_A4: U?#2.G1(A4)
FMC_A5: U?#2.G2(A5)
FMC_A6: U?#2.G3(A6)
FMC_A7: U?#2.H1(A7)
FMC_A8: U?#2.H2(A8)
FMC_A9: U?#2.J3(A9)
FMC_A10: U?#2.G7(A10)
FMC_A11: U?#2.H9(A11)
FMC_BA0: U?#2.J7(BA0) ; port FMC_BA0
FMC_BA1: U?#2.H8(BA1) ; port FMC_BA1
FMC_D0: U?#2.R8(DQ0)
FMC_D1: U?#2.N7(DQ1)
FMC_D2: U?#2.R9(DQ2)
FMC_D3: U?#2.N8(DQ3)
FMC_D4: U?#2.P9(DQ4)
FMC_D5: U?#2.M8(DQ5)
FMC_D6: U?#2.M7(DQ6)
FMC_D7: U?#2.L8(DQ7)
FMC_D8: U?#2.L2(DQ8)
FMC_D9: U?#2.M3(DQ9)
FMC_D10: U?#2.M2(DQ10)
FMC_D11: U?#2.P1(DQ11)
FMC_D12: U?#2.N2(DQ12)
FMC_D13: U?#2.R1(DQ13)
FMC_D14: U?#2.N3(DQ14)
FMC_D15: U?#2.R2(DQ15)
FMC_D16: R?#5.2 U?#2.E8(DQ16)
FMC_D17: R?#6.2 U?#2.D7(DQ17)
FMC_D18: R?#7.2 U?#2.D8(DQ18)
FMC_D19: R?#8.2 U?#2.B9(DQ19)
FMC_D20: R?#9.2 U?#2.C8(DQ20)
FMC_D21: R?#10.2 U?#2.A9(DQ21)
FMC_D22: R?#11.2 U?#2.C7(DQ22)
FMC_D23: R?#12.2 U?#2.A8(DQ23)
FMC_D24: R?#13.2 U?#2.A2(DQ24)
FMC_D25: R?#14.2 U?#2.C3(DQ25)
FMC_D26: R?#15.2 U?#2.A1(DQ26)
FMC_D27: R?#16.2 U?#2.C2(DQ27)
FMC_D28: R?#17.2 U?#2.B1(DQ28)
FMC_D29: R?#18.2 U?#2.D2(DQ29)
FMC_D30: R?#19.2 U?#2.D3(DQ30)
FMC_D31: R?#20.2 U?#2.E2(DQ31)
FMC_NBL0: U?#2.K9(DQM0) ; port FMC_NBL0
FMC_NBL1: U?#2.K1(DQM1) ; port FMC_NBL1
FMC_SDCKE0: U?#2.J2(CKE) ; port FMC_SDCCKE0
FMC_SDCLK: U?#2.J1(CLK) ; port FMC_SDCLK
FMC_SDNCAS: U?#2.K7(CAS#) ; port FMC_SDNCAS
FMC_SDNE0: U?#2.J8(CS#) ; port FMC_SDNE0
FMC_SDNRAS: U?#2.J9(RAS#) ; port FMC_SDNRAS
FMC_SDNWE: U?#2.K8(WE#) ; port FMC_SNWE
NetR?#3_1: R?#3.1 U?#2.F2(DQM3)
NetR?#4_1: R?#4.1 U?#2.F8(DQM2)

Not connected (* = marked no-connect by the designer): U?#2 E3(NC_1) E7(NC_2) H3(NC_3) H7(NC_4) K2(NU) K3(NC_5)

### Buses and harness runs
bus FMC_A[0..11] = port FMC_A[0..11]
bus FMC_D[0..15] = port FMC_D[0..15]

### Layout directives
net class FMC_Data: (no net found under the mark)
net class FMC_Address: (no net found under the mark)

### Notes on the sheet
- SDRAM
- CONFIDENTAL. Do not distribute.
- CLOCKS (CPU & PCIE)
- Variant:
- Checked by
- (in symbol SDTitleBlock) Title:; Page Contents:; Revision:; Size:; DWG NO; Date:; Sheet; of

### Library data of the parts
C?#28-C?#41 = C1005X5R1H104K: CAP CER .10UF 50V X5R 10% 0402; Manufacturer: TDK Corporation; Capacitance: 0.1µF; Value: 100nF; .Checked PCB: used; Category: Capacitors; Supplier Part Number: 445-5942-1-ND; Manufacturer Part Number: C1005X5R1H104K; Operating Temperature: -55°C ~ 85°C; Package / Case: 0402 (1005 Metric); Price 1k [$]: 0.02340; .Checked SCH: used; Voltage - Rated: 50V; Supplier: Digikey; Supplier 1: Digi-Key; Supplier Part Number 1: 445-5942-1-ND; RoHS: RoHS Compliant; Stock 1: 106926; Pricing 1: 1=0.27, 10=0.18, 100=0.072, 250=0.05176, 500=0.0369, 1000=0.027 (USD); Tolerance: ±10%; Temperature Coefficient: X5R; Mounting Type: Surface Mount, MLCC; Applications: General Purpose; Ratings: -; Size / Dimension: 0.039" L x 0.020" W (1.00mm x 0.50mm); Height - Seated (Max): -; Thickness (Max): 0.022" (0.55mm); Lead Spacing: -; Features: -; Packaging: Cut Tape (CT); Lead Style: -; ComponentLink1URL: http://www.tdk.co.jp/tefe02/e412_c.pdf; ComponentLink1Description: http://www.tdk.co.jp/tefe02/e412_c.pdf
R?#3-R?#20 = RC0402FR-0710KL: RES 10.0K OHM 1/16W 1% 0402 SMD; Manufacturer: Yageo; Power (Watts): 0.063W, 1/16W; .Checked PCB: used; Temperature Coefficient: ±100ppm/°C; Category: Resistors; Supplier Part Number: 311-10.0KLRCT-ND; Manufacturer Part Number: RC0402FR-0710KL; Package / Case: 0402 (1005 Metric); Price 1k [$]: 0.01421; Resistance (Ohms): 10K; Tolerance: ±1%; Value: 10k; .Checked SCH: used; Supplier: Digikey; Supplier 1: Digi-Key; Supplier Part Number 1: 311-10.0KLRCT-ND; RoHS: RoHS Compliant; Stock 1: 2916495; Pricing 1: 10=0.014, 50=0.0104, 100=0.0079, 250=0.00584, 500=0.00432, 1000=0.00288 (USD); Composition: Thick Film; Features: -; Size / Dimension: 0.039" L x 0.020" W (1.00mm x 0.50mm); Height: 0.016" (0.40mm); Number of Terminations: 2; Packaging: Cut Tape (CT); ComponentLink1URL: http://www.yageo.com/documents/recent/PYu-RC0402_51_RoHS_L_6.pdf; ComponentLink1Description: http://www.yageo.com/documents/recent/PYu-RC0402_51_RoHS_L_6.pdf
U?#2 = MT48LC4M32B2B5-6A_XIT_L_TR: Integrated Circuit; Manufacturer_Name: Micron; Manufacturer_Part_Number: MT48LC4M32B2B5-6A XIT:L TR; Datasheet Link: http://www.micron.com/~/media/Documents/Products/Data%20Sheet/DRAM/128mb_x32_sdram.pdf; Height: 0.7mm; Mouser Part Number: 340-140098-REEL; Mouser Price/Stock: https://www.mouser.com/Search/Refine.aspx?Keyword=340-140098-REEL

## Sheet [05] - QSPI FLASH.SchDoc
size A3; DocumentNumber: 5; SheetNumber: 5; SheetTotal: 18
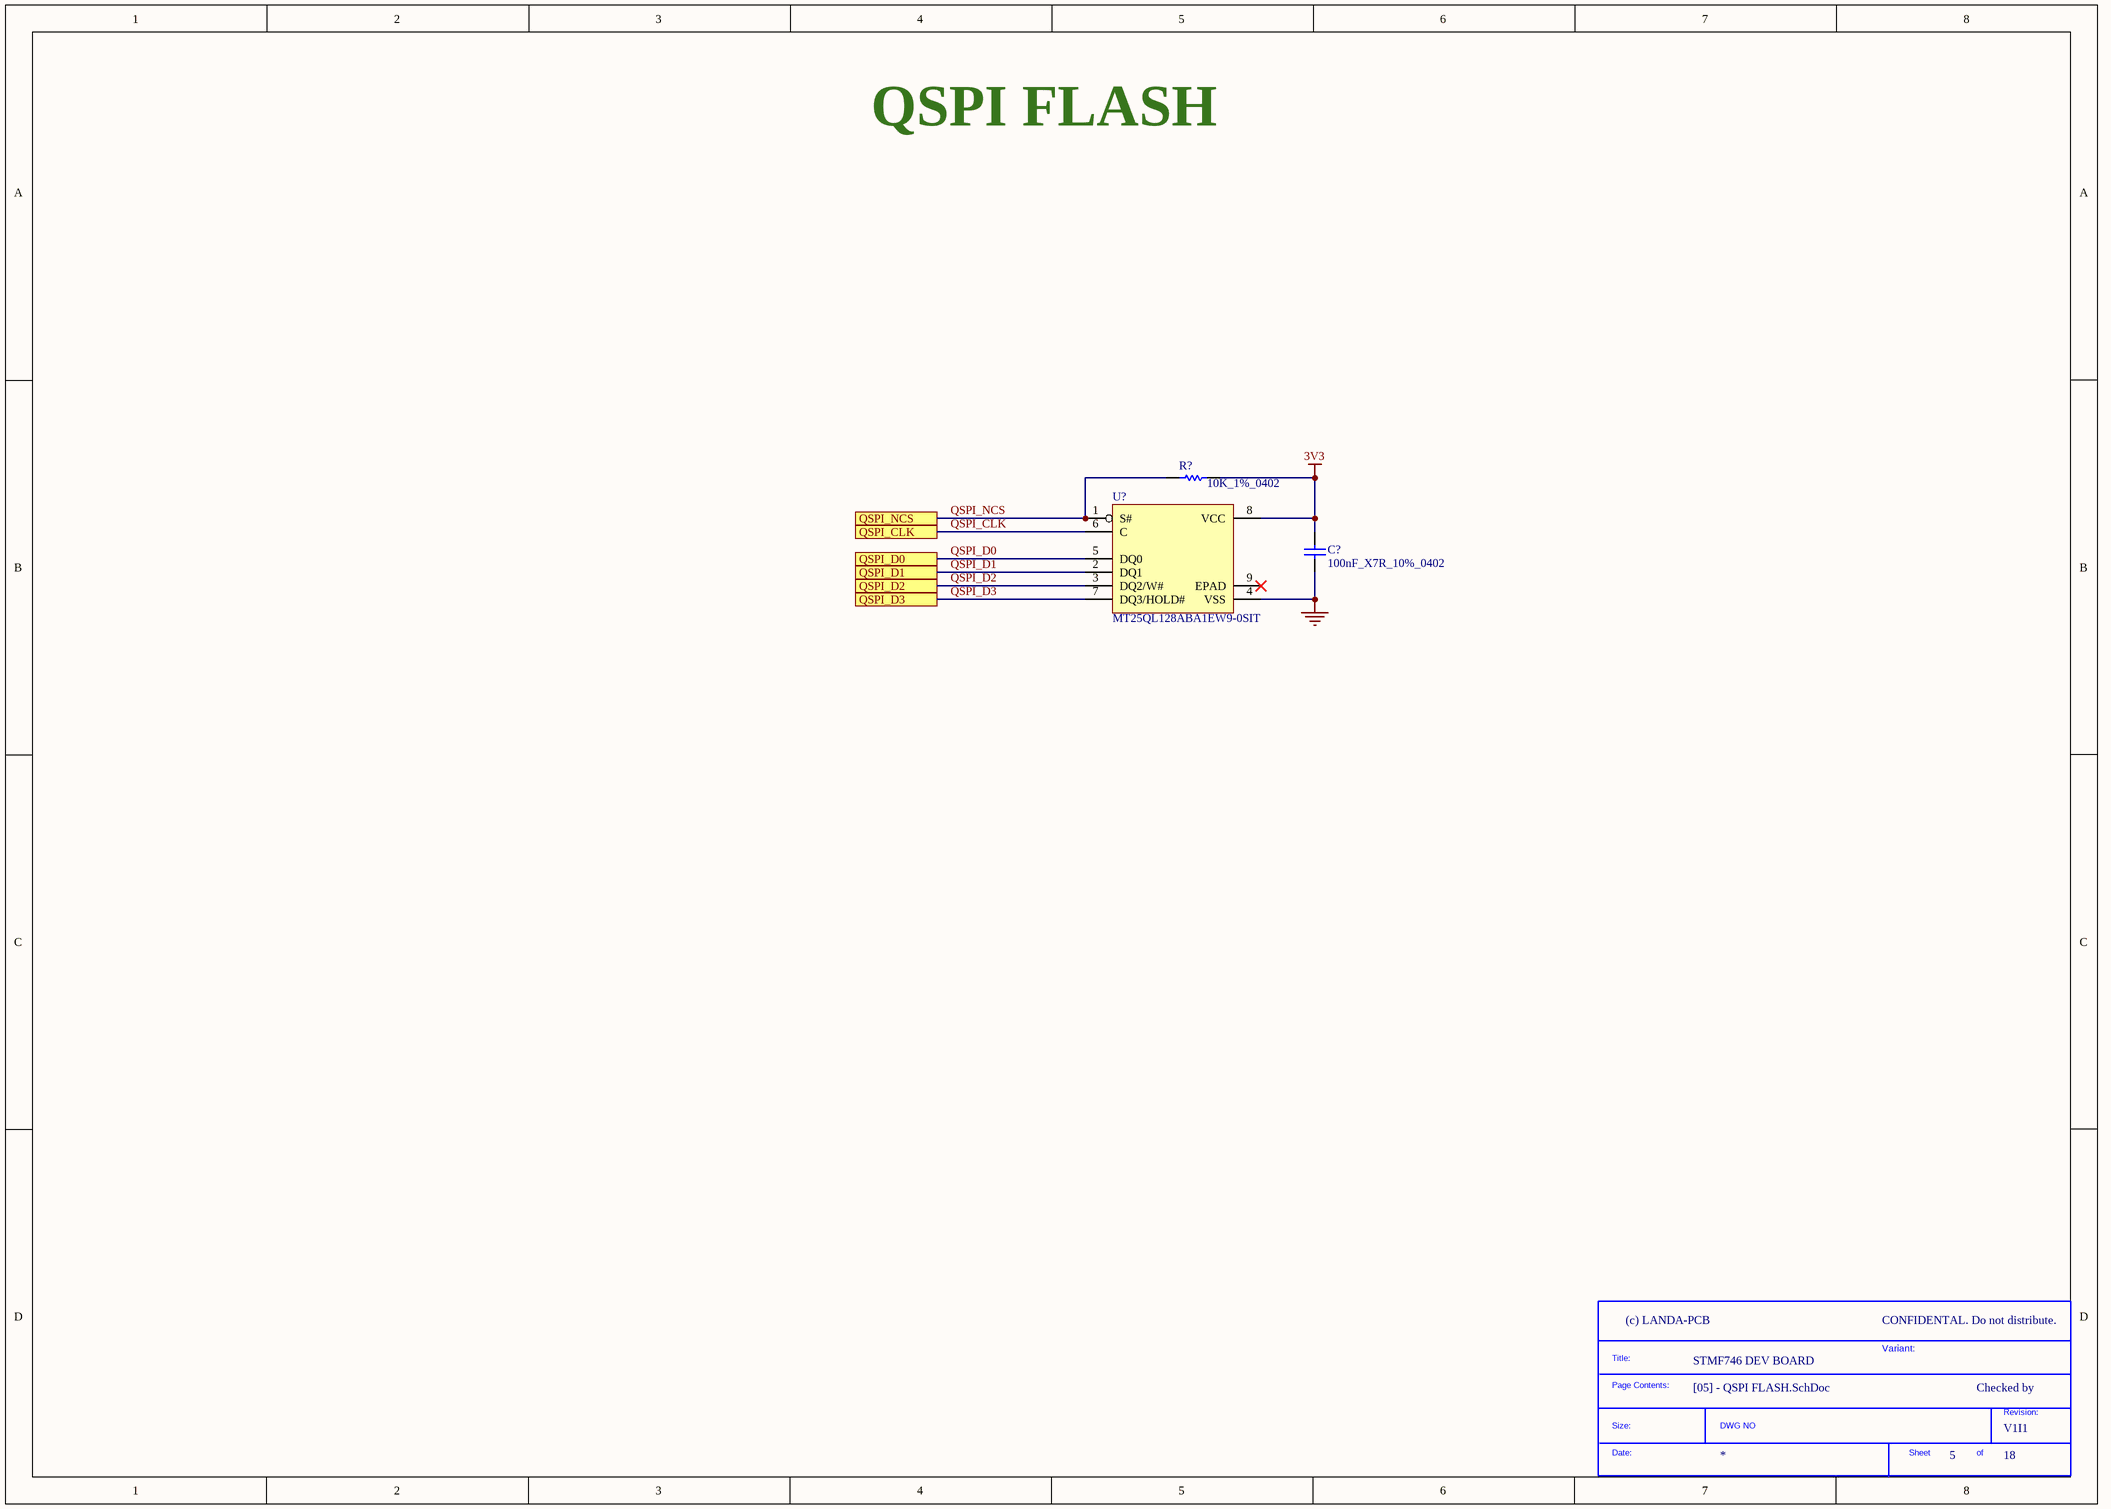
[diagram p6: [05] - QSPI FLASH.SchDoc]

### Parts
(Parts that share a designator on the sheet are numbered #1, #2 ... from top to bottom, then left to right.)
*#7  SDTitleBlock  (value not drawn)  (graphical)
C?#42  100nF_X7R_10%_0402  [0402C]
R?#21  10K_1%_0402  [0402R]
U?#3  MT25QL128ABA1EW9-0SIT  [W-PDFN-8_8X6_P127]

### Ports
QSPI_CLK, QSPI_D0, QSPI_D1, QSPI_D2, QSPI_D3, QSPI_NCS

### Nets
3V3: C?#42.2 R?#21.2 U?#3.8(VCC)  [project net 3V3_uSD]
GND: C?#42.1 U?#3.4(VSS)
QSPI_CLK: U?#3.6(C) ; port QSPI_CLK
QSPI_D0: U?#3.5(DQ0) ; port QSPI_D0
QSPI_D1: U?#3.2(DQ1) ; port QSPI_D1
QSPI_D2: U?#3.3(DQ2/W#) ; port QSPI_D2
QSPI_D3: U?#3.7(DQ3/HOLD#) ; port QSPI_D3
QSPI_NCS: R?#21.1 U?#3.1(S#) ; port QSPI_NCS

Not connected (* = marked no-connect by the designer): U?#3 9(EPAD)*

### Notes on the sheet
- QSPI FLASH
- CONFIDENTAL. Do not distribute.
- CLOCKS (CPU & PCIE)
- Variant:
- Checked by
- (in symbol SDTitleBlock) Title:; Page Contents:; Revision:; Size:; DWG NO; Date:; Sheet; of

### Library data of the parts
C?#42 = Cap_100nF_X7R_10%_0402: Capacitor,100nF,16V,X7R,10%,0402,YAGEO; Manuf_Part_1: CC0402KRX7R7BB104; Revision: July-2002: Re-released for DXP Platform.; Value: 100nF; Order: CC0402KRX7R7BB104; Manuf_1: YAGEO; ECCN_US/EU: n/a
R?#21 = Res_10K_1%_0402: Resistor,10K,0402,1%,YAGEO; Manuf_Part_1: RC0402FR-0710KL; Value: 10K; Manuf_1: YAGEO; Order: RC0402FR-0710KL; ECCN_US/EU: n/a
U?#3 = MT25QL128ABA1EW9-0SIT: 128Mb, 3V, Multiple I/O Serial Flash Memory, Quad/Dual; Manuf_1: MICRON; ECCN_US/EU: 3A991/NEC; Provided: ST; Manuf_Part_1: MT25QL128ABA1EW9-0SIT; Value: MT25QL128ABA1EW9-0SIT

## Sheet [06] - SD CARD.SchDoc
size A3; DocumentNumber: 6; SheetNumber: 6; SheetTotal: 18
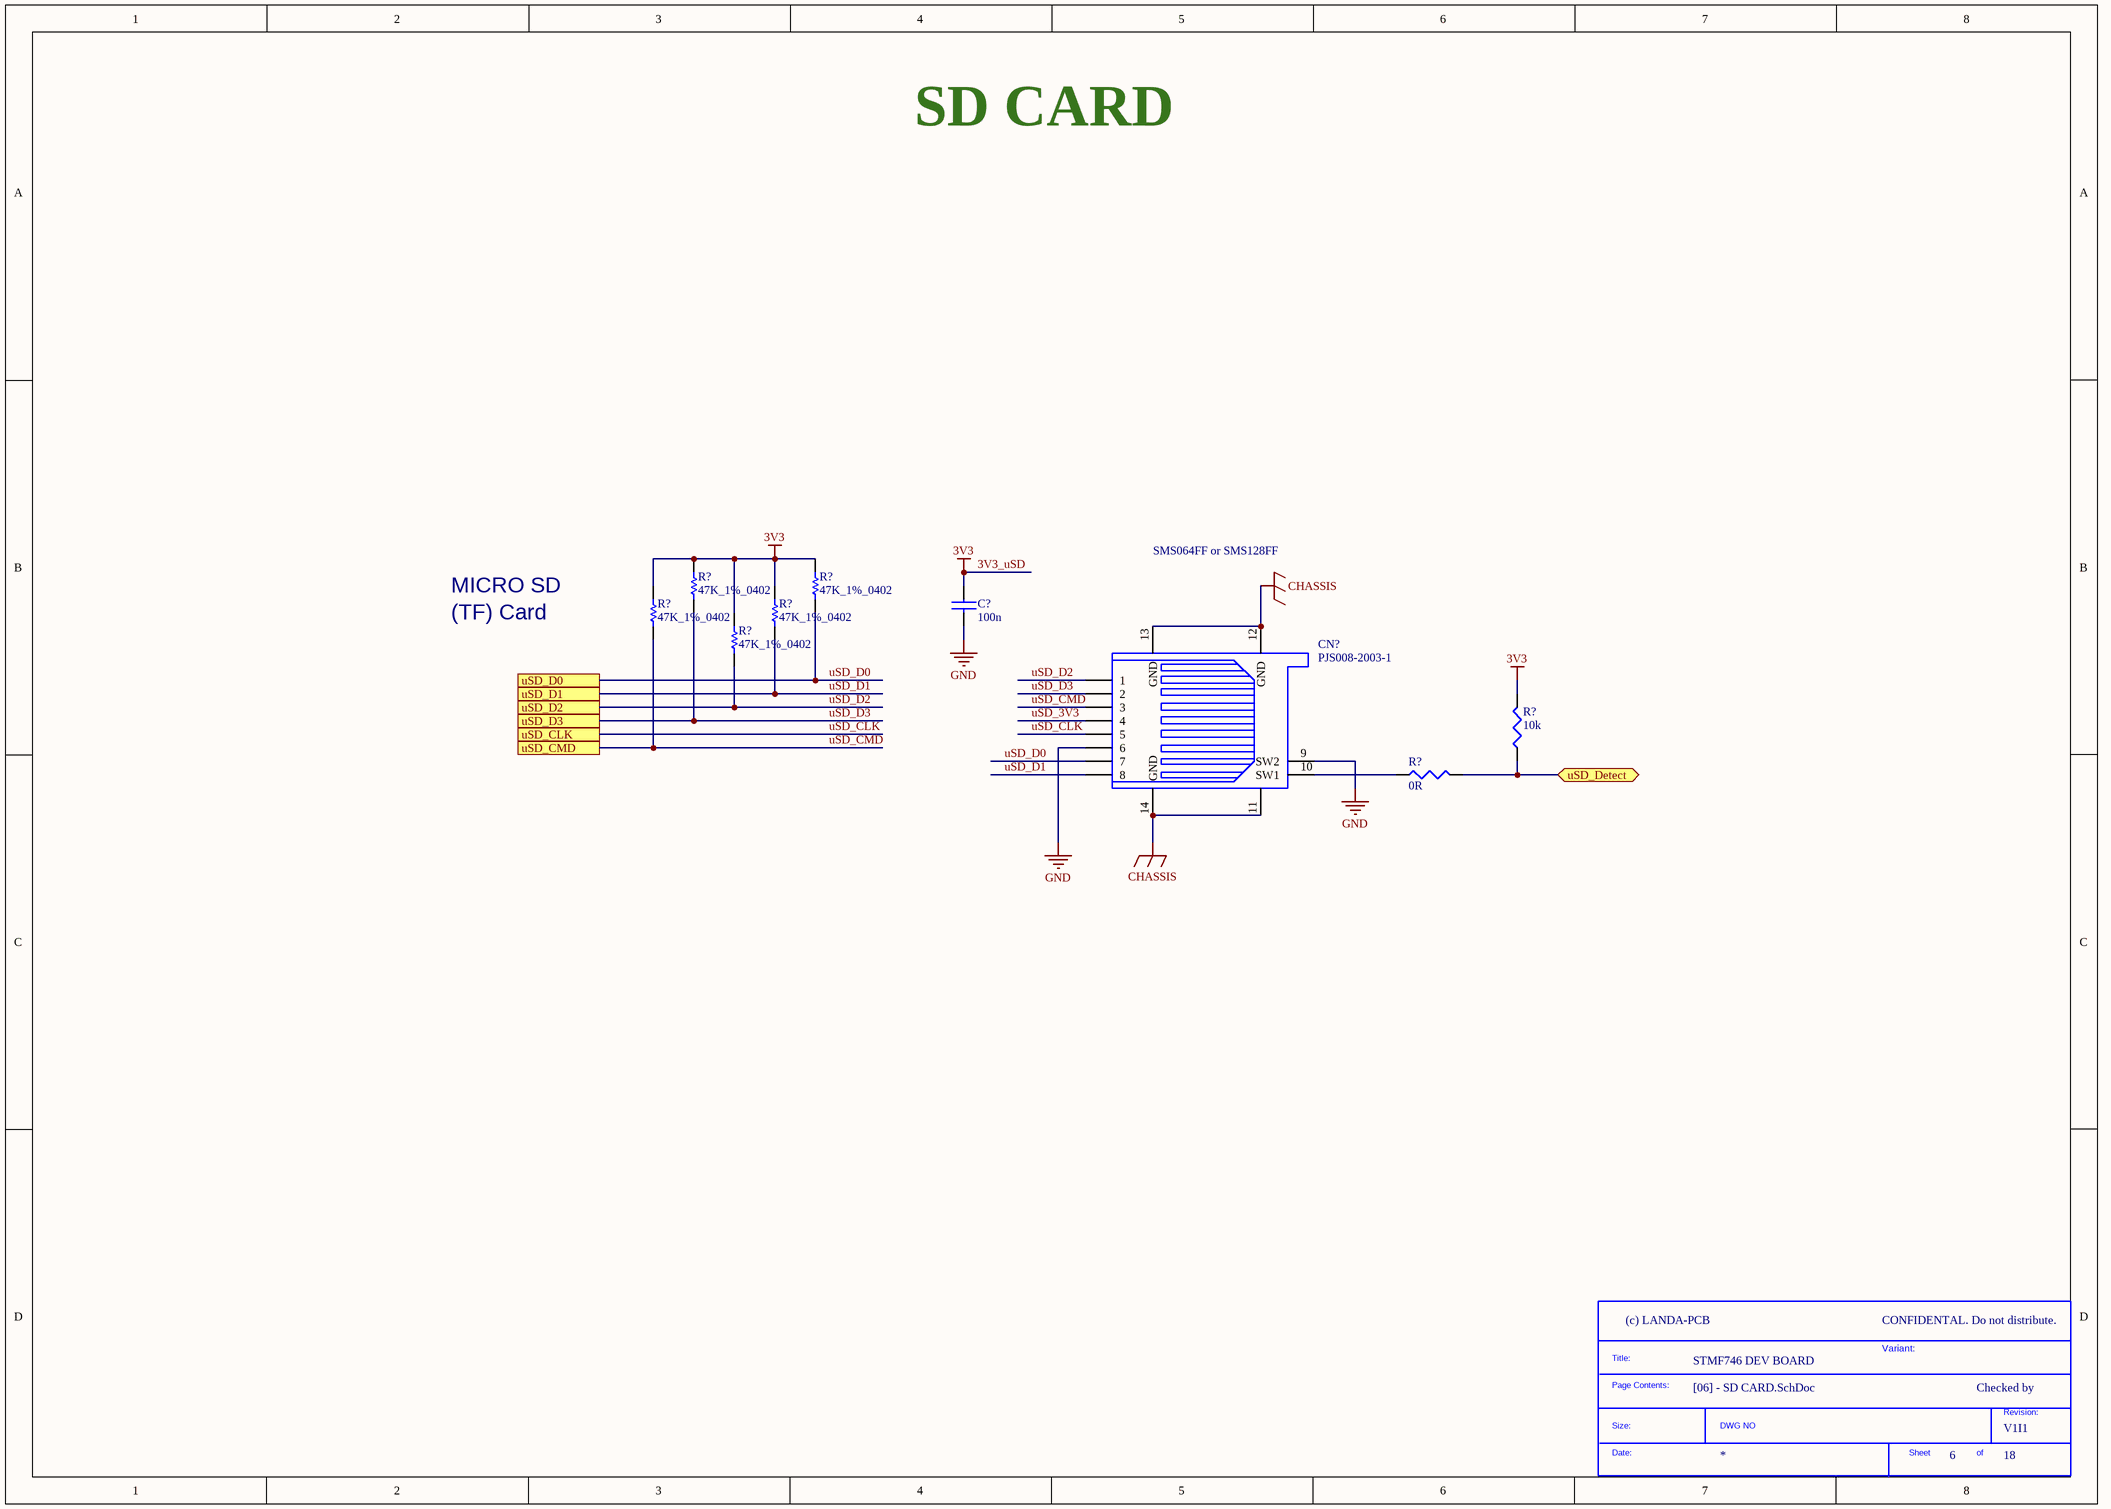
[diagram p7: [06] - SD CARD.SchDoc]

### Parts
(Parts that share a designator on the sheet are numbered #1, #2 ... from top to bottom, then left to right.)
*#8  SDTitleBlock  (value not drawn)  (graphical)
C?#43  100n  [C0402]
CN?#1  PJS008-2003-1  [PJS008-2003-1]
R?#22  47K_1%_0402  [0402R]
R?#23  47K_1%_0402  [0402R]
R?#24  47K_1%_0402  [0402R]
R?#25  47K_1%_0402  [0402R]
R?#26  47K_1%_0402  [0402R]
R?#27  10k  [R0402]
R?#28  0R  [R0402]

### Ports
uSD_CLK, uSD_CMD, uSD_D0, uSD_D1, uSD_D2, uSD_D3, uSD_Detect (bidir)

### Nets
3V3_uSD: C?#43.1 R?#22.2 R?#23.2 R?#24.2 R?#25.2 R?#26.2 R?#27.2  [also labelled 3V3]
CHASSIS: CN?#1.11(GND) CN?#1.12(GND) CN?#1.13(GND) CN?#1.14(GND)
GND: C?#43.2 CN?#1.6 CN?#1.9(SW2)
uSD_3V3: CN?#1.4
uSD_CLK: CN?#1.5 ; port uSD_CLK
uSD_CMD: CN?#1.3 R?#24.1 ; port uSD_CMD
uSD_D0: CN?#1.7 R?#23.1 ; port uSD_D0
uSD_D1: CN?#1.8 R?#25.1 ; port uSD_D1
uSD_D2: CN?#1.1 R?#26.1 ; port uSD_D2
uSD_D3: CN?#1.2 R?#22.1 ; port uSD_D3
NetCN?#1_10: CN?#1.10(SW1) R?#28.1
NetR?#27_1: R?#27.1 R?#28.2 ; port uSD_Detect

### Notes on the sheet
- SD CARD
- SMS064FF or SMS128FF
- MICRO SD
- (TF) Card
- CONFIDENTAL. Do not distribute.
- CLOCKS (CPU & PCIE)
- Variant:
- Checked by
- (in symbol SDTitleBlock) Title:; Page Contents:; Revision:; Size:; DWG NO; Date:; Sheet; of

### Library data of the parts
C?#43 = C1005X5R1H104K: as C?#28 on sheet [04] - SDRAM; Category: Capacitors; Supplier Part Number: 445-5942-1-ND; Manufacturer Part Number: C1005X5R1H104K; Operating Temperature: -55°C ~ 85°C; Package / Case: 0402 (1005 Metric); Price 1k [$]: 0.02340; .Checked SCH: used; Voltage - Rated: 50V; Supplier: Digikey; Supplier 1: Digi-Key; Supplier Part Number 1: 445-5942-1-ND; RoHS: RoHS Compliant; Stock 1: 106926; Pricing 1: 1=0.27, 10=0.18, 100=0.072, 250=0.05176, 500=0.0369, 1000=0.027 (USD); Tolerance: ±10%; Temperature Coefficient: X5R; Mounting Type: Surface Mount, MLCC; Applications: General Purpose; Ratings: -; Size / Dimension: 0.039" L x 0.020" W (1.00mm x 0.50mm); Height - Seated (Max): -; Thickness (Max): 0.022" (0.55mm); Lead Spacing: -; Features: -; Packaging: Cut Tape (CT); Lead Style: -; ComponentLink1URL: http://www.tdk.co.jp/tefe02/e412_c.pdf; ComponentLink1Description: http://www.tdk.co.jp/tefe02/e412_c.pdf
CN?#1 = microSD-PJS008-2003: Memory Card Connectors MicroSD Card Conn Revrs Mnt Push-Push; Manuf_1: YAMAICHI; Manuf_Part_1: PJS008-2003-1; ECCN_US/EU: N/A; Order: PJS008-2003-1
R?#22-R?#26 = Res_47K_1%_0402: Resistor,47K,0402,1%,YAGEO; Manuf_Part_1: RC0402FR-0747KL; Order: 9239430; Value: 47K; Manuf_1: YAGEO; ECCN_US/EU: n/a; Distrib: FARNELL
R?#27 = RC0402FR-0710KL: as R?#3 on sheet [04] - SDRAM; Category: Resistors; Supplier Part Number: 311-10.0KLRCT-ND; Manufacturer Part Number: RC0402FR-0710KL; Package / Case: 0402 (1005 Metric); Price 1k [$]: 0.01421; Resistance (Ohms): 10K; Tolerance: ±1%; Value: 10k; .Checked SCH: used; Supplier: Digikey; Supplier 1: Digi-Key; Supplier Part Number 1: 311-10.0KLRCT-ND; RoHS: RoHS Compliant; Stock 1: 2916495; Pricing 1: 10=0.014, 50=0.0104, 100=0.0079, 250=0.00584, 500=0.00432, 1000=0.00288 (USD); Composition: Thick Film; Features: -; Size / Dimension: 0.039" L x 0.020" W (1.00mm x 0.50mm); Height: 0.016" (0.40mm); Number of Terminations: 2; Packaging: Cut Tape (CT); ComponentLink1URL: http://www.yageo.com/documents/recent/PYu-RC0402_51_RoHS_L_6.pdf; ComponentLink1Description: http://www.yageo.com/documents/recent/PYu-RC0402_51_RoHS_L_6.pdf
R?#28 = CRCW0402330RFKED: RES 330 OHM 1/16W 1% 0402 SMD; Manufacturer: Vishay Dale; Resistance (Ohms): 330; Power (Watts): 0.063W, 1/16W; Temperature Coefficient: ±100ppm/°C; .Checked PCB: RF; Supplier 1: Digi-Key; Supplier Part Number 1: 541-330LCT-ND; Manufacturer Part Number: CRCW0402330RFKED; RoHS: RoHS Compliant; Category: Resistors; Stock 1: 49303; Pricing 1: 10=0.083, 50=0.0444, 200=0.0255, 1000=0.0174 (USD); Composition: Thick Film; Features: -; Tolerance: ±1%; Package / Case: 0402 (1005 Metric); Size / Dimension: 0.039" L x 0.020" W (1.00mm x 0.50mm); Height: 0.016" (0.40mm); Number of Terminations: 2; Packaging: Cut Tape (CT); ComponentLink1URL: http://www.vishay.com/doc?20035; ComponentLink1Description: http://www.vishay.com/doc?20035; .Checked SCH: RF

## Sheet [16] - CTRL MOTOR.SchDoc
size A3; DocumentNumber: 16; SheetNumber: 16; SheetTotal: 18
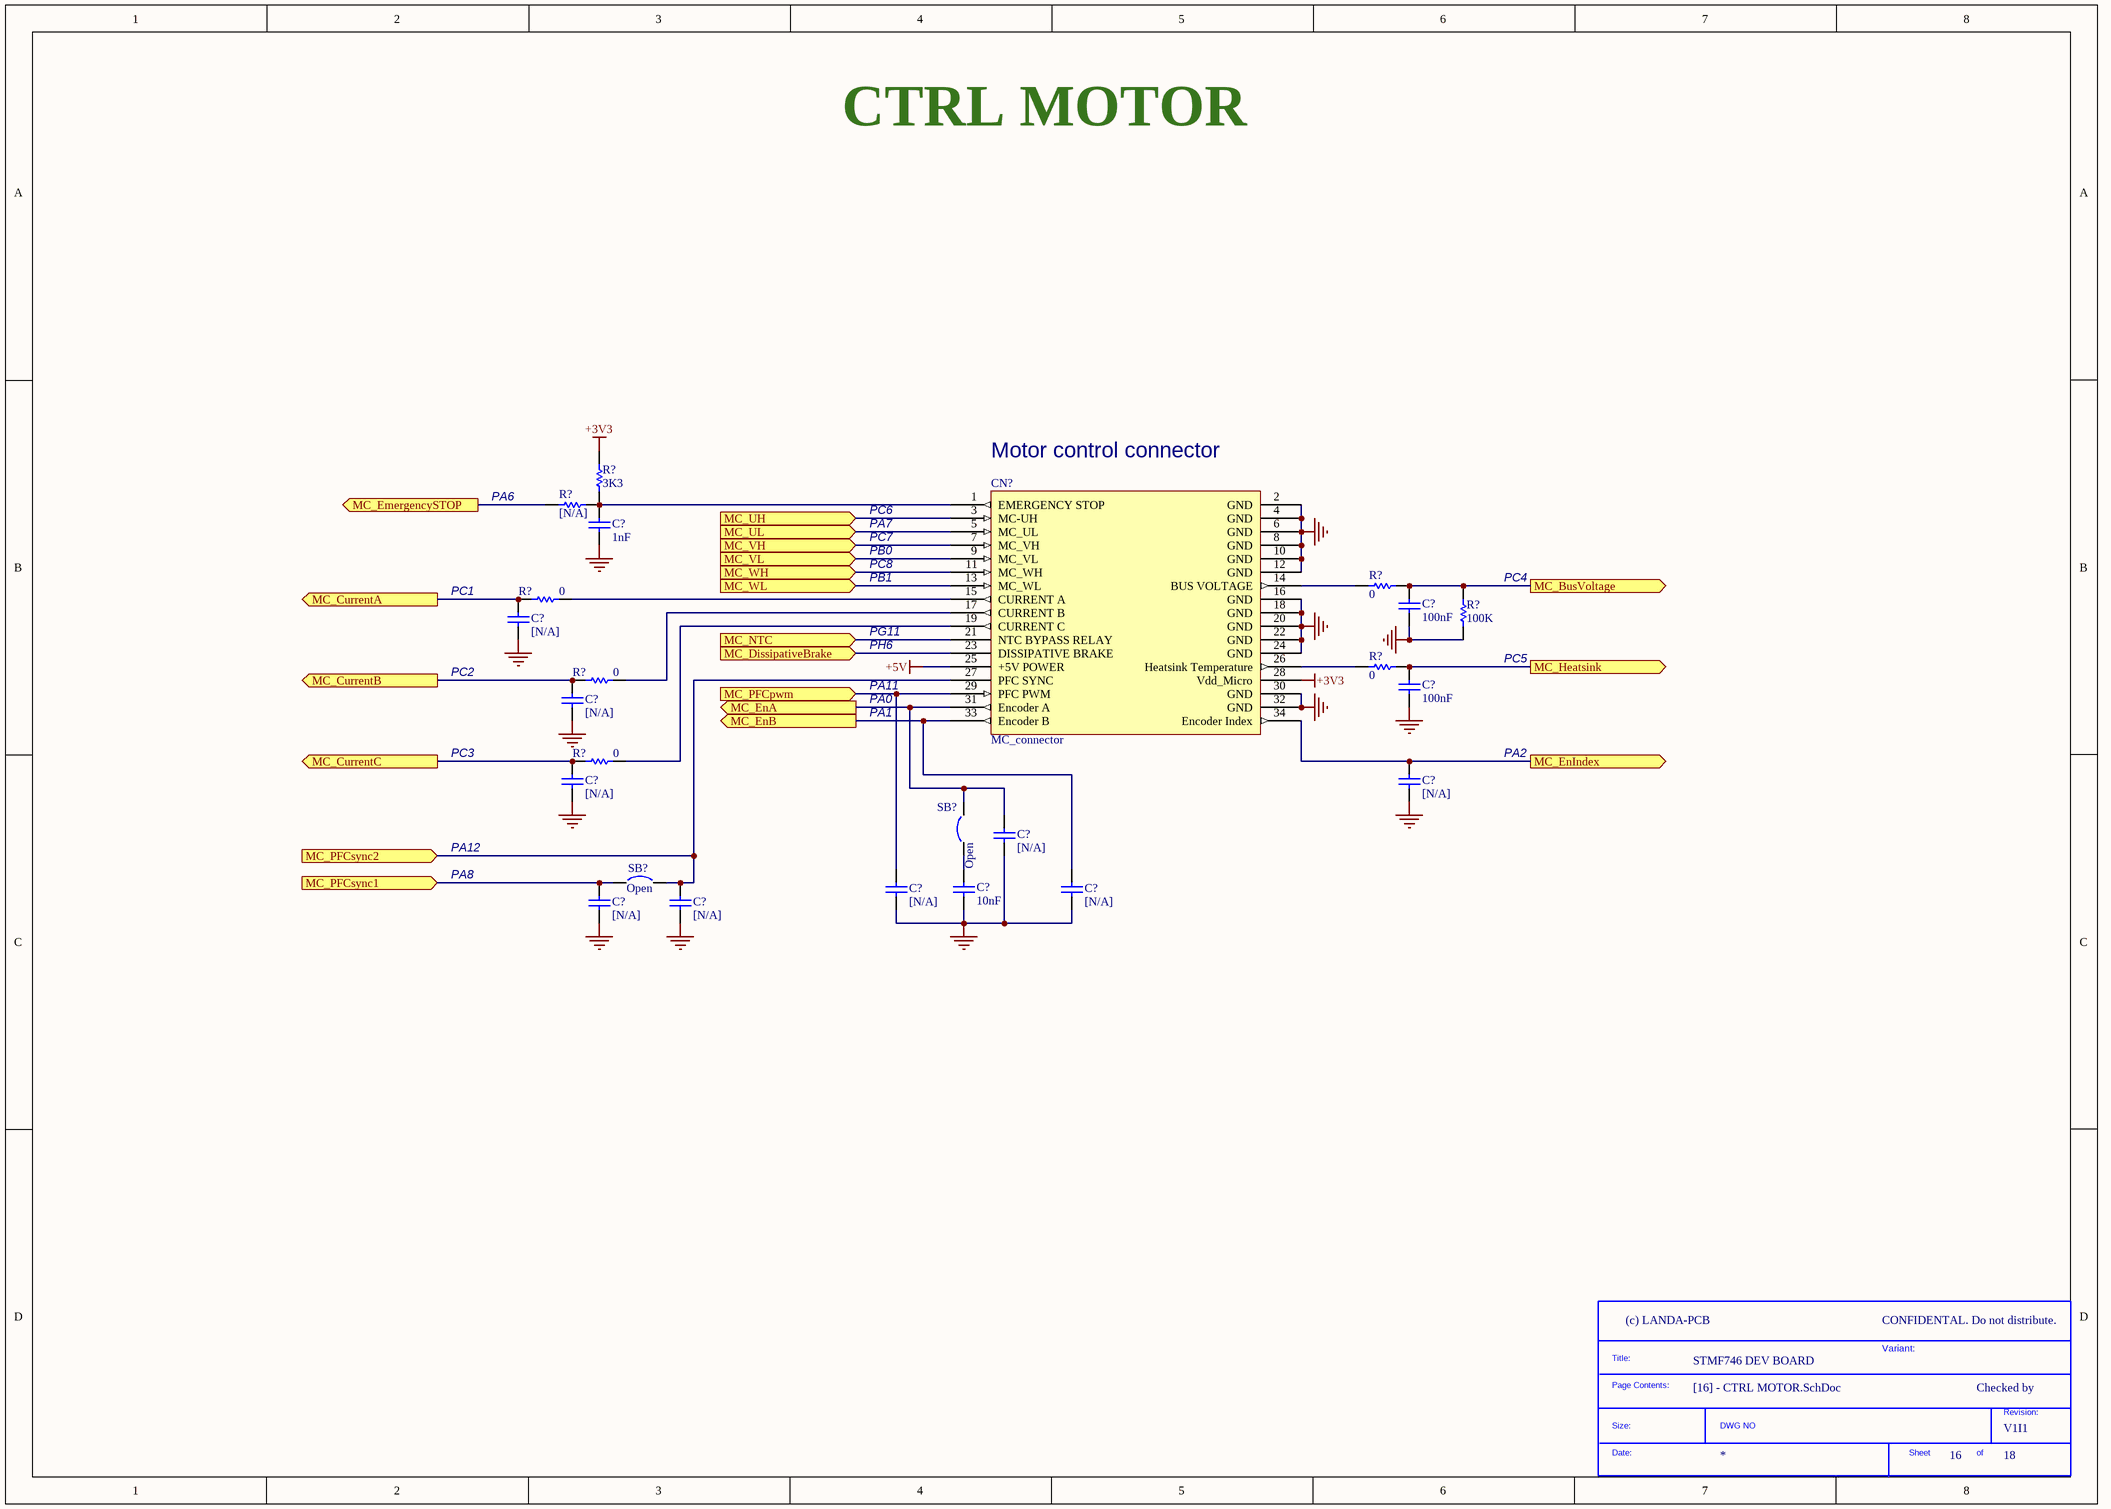
[diagram p8: [16] - CTRL MOTOR.SchDoc]

### Parts
(Parts that share a designator on the sheet are numbered #1, #2 ... from top to bottom, then left to right.)
*#9  SDTitleBlock  (value not drawn)  (graphical)
C?#44  1nF  [0603C]
C?#45  100nF  [0603C]
C?#46  [N/A]  [0603C]
C?#47  100nF  [0603C]
C?#48  [N/A]  [0603C]
C?#49  [N/A]  [0603C]
C?#50  [N/A]  [0603C]
C?#51  [N/A]  [0603C]
C?#52  10nF  [0603C]
C?#53  [N/A]  [0603C]
C?#54  [N/A]  [0603C]
C?#55  [N/A]  [0603C]
C?#56  [N/A]  [0603C]
CN?#2  MC_connector  [IDC34S]
R?#29  3K3  [0603R]
R?#30  [N/A]  [0603R]
R?#31  0  [0603R]
R?#32  0  [0603R]
R?#33  100K  [0603R]
R?#34  0  [0603R]
R?#35  0  [0603R]
R?#36  0  [0603R]
SB?#1  Open  [SB_0603]
SB?#2  Open  [SB_0603]

### Ports
MC_BusVoltage (out), MC_CurrentA (out), MC_CurrentB (out), MC_CurrentC (out), MC_DissipativeBrake (in), MC_EmergencySTOP (out), MC_EnA (out), MC_EnB (out), MC_EnIndex (out), MC_Heatsink (out), MC_NTC (in), MC_PFCpwm (in), MC_PFCsync1 (in), MC_PFCsync2 (in), MC_UH (in), MC_UL (in), MC_VH (in), MC_VL (in), MC_WH (in), MC_WL (in)

### Nets
+3V3: CN?#2.28(Vdd_Micro) R?#29.2
+5V: CN?#2.25(+5V_POWER)
GND: C?#44.1 C?#45.2 C?#46.1 C?#47.2 C?#48.1 C?#49.1 C?#50.1 C?#51.1 C?#52.2 C?#53.1 C?#54.1 C?#55.1 C?#56.1 CN?#2.2(GND) CN?#2.4(GND) CN?#2.6(GND) CN?#2.8(GND) CN?#2.10(GND) CN?#2.12(GND) CN?#2.16(GND) CN?#2.18(GND) CN?#2.20(GND) CN?#2.22(GND) CN?#2.24(GND) CN?#2.30(GND) CN?#2.32(GND) R?#33.2
NetC?#44_2: C?#44.2 CN?#2.1(EMERGENCY_STOP) R?#29.1 R?#30.1
NetC?#45_1: C?#45.1 R?#31.2 R?#33.1 ; port MC_BusVoltage
NetC?#46_2: C?#46.2 R?#32.1 ; port MC_CurrentA
NetC?#47_1: C?#47.1 R?#34.2 ; port MC_Heatsink
NetC?#48_2: C?#48.2 R?#35.1 ; port MC_CurrentB
NetC?#49_2: C?#49.2 R?#36.1 ; port MC_CurrentC
NetC?#50_2: C?#50.2 CN?#2.34(Encoder_Index) ; port MC_EnIndex
NetC?#51_2: C?#51.2 CN?#2.31(Encoder_A) SB?#1.2 ; port MC_EnA
NetC?#52_1: C?#52.1 SB?#1.1
NetC?#53_2: C?#53.2 CN?#2.29(PFC_PWM) ; port MC_PFCpwm
NetC?#54_2: C?#54.2 CN?#2.33(Encoder_B) ; port MC_EnB
NetC?#55_2: C?#55.2 SB?#2.1 ; port MC_PFCsync1
NetC?#56_2: C?#56.2 CN?#2.27(PFC_SYNC) SB?#2.2 ; port MC_PFCsync2
NetCN?#2_3: CN?#2.3(MC-UH) ; port MC_UH
NetCN?#2_5: CN?#2.5(MC_UL) ; port MC_UL
NetCN?#2_7: CN?#2.7(MC_VH) ; port MC_VH
NetCN?#2_9: CN?#2.9(MC_VL) ; port MC_VL
NetCN?#2_11: CN?#2.11(MC_WH) ; port MC_WH
NetCN?#2_13: CN?#2.13(MC_WL) ; port MC_WL
NetCN?#2_14: CN?#2.14(BUS_VOLTAGE) R?#31.1
NetCN?#2_15: CN?#2.15(CURRENT_A) R?#32.2
NetCN?#2_17: CN?#2.17(CURRENT_B) R?#35.2
NetCN?#2_19: CN?#2.19(CURRENT_C) R?#36.2
NetCN?#2_21: CN?#2.21(NTC_BYPASS_RELAY) ; port MC_NTC
NetCN?#2_23: CN?#2.23(DISSIPATIVE_BRAKE) ; port MC_DissipativeBrake
NetCN?#2_26: CN?#2.26(Heatsink_Temperature) R?#34.1
NetR?#30_2: R?#30.2 ; port MC_EmergencySTOP

### Notes on the sheet
- CTRL MOTOR
- (near R?#30) PA6
- PC6
- (near CN?#2) Motor control connector
- PA7
- PB0
- PB1
- PC7
- PC8
- (near R?#33) PC4
- PC1
- PG11
- PH6
- PC2
- PA1
- PA0
- PA11
- (near R?#33) PC5
- PC3
- PA2
- PA12
- PA8
- CONFIDENTAL. Do not distribute.
- CLOCKS (CPU & PCIE)
- Variant:
- Checked by
- (in symbol SDTitleBlock) Title:; Page Contents:; Revision:; Size:; DWG NO; Date:; Sheet; of

### Library data of the parts
C?#44 C?#52 = CAP: Capacitor; Value: 100pF; Published: 8-Jun-2000; Revision: July-2002: Re-released for DXP Platform.; Publisher: Altium Limited
C?#45 C?#47 = Cap: Capacitor; Value: 10nF; Published: 8-Jun-2000; Revision: July-2002: Re-released for DXP Platform.; Publisher: Altium Limited
C?#46 C?#48-C?#51 C?#53-C?#56 = cap: Capacitor; Value: 100pF; Published: 8-Jun-2000; Revision: July-2002: Re-released for DXP Platform.; Publisher: Altium Limited
R?#29-R?#32 R?#34-R?#36 = Res1: Resistor; Value: 1K; Published: 8-Jun-2000; Revision: July-2002: Re-released for DXP Platform.; Publisher: Altium Limited
R?#33 = res1: Resistor; Value: 1K; Published: 8-Jun-2000; Revision: July-2002: Re-released for DXP Platform.; Publisher: Altium Limited
SB?#1 SB?#2 = Circuit Breaker: Published: 24-Mar-1999; Revision: July-2002: Re-released for DXP Platform.; Publisher: Altium Limited

## Sheet [07] - JTAG.SchDoc
size A3; DocumentNumber: 7; SheetNumber: 7; SheetTotal: 18
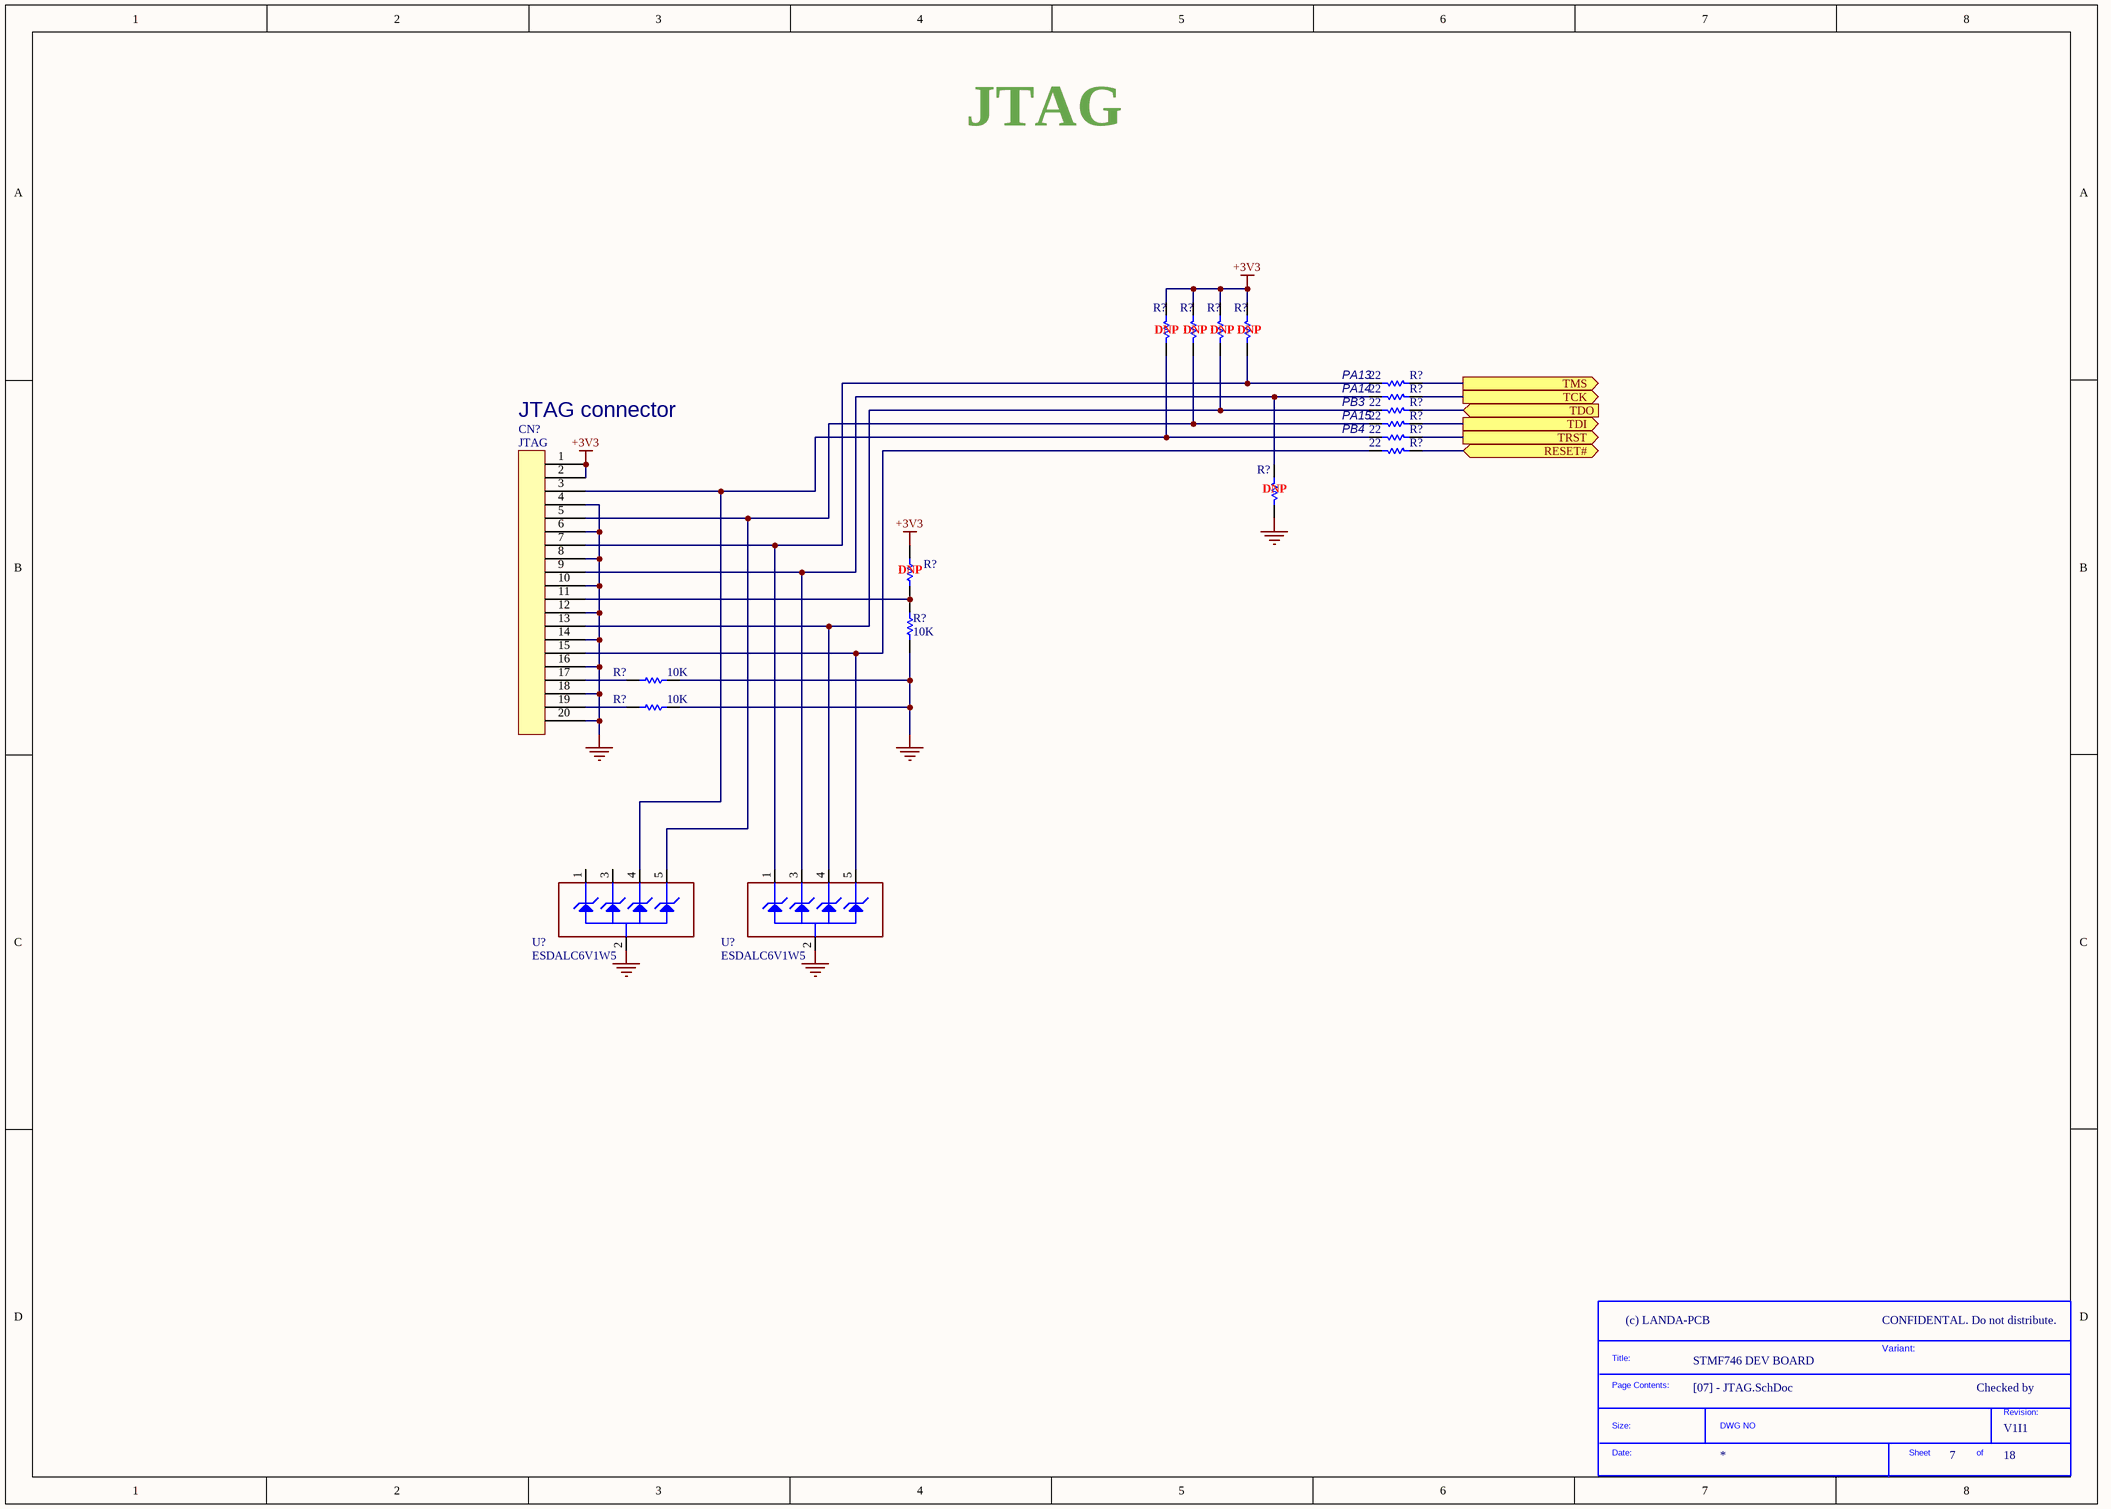
[diagram p9: [07] - JTAG.SchDoc]

### Parts
(Parts that share a designator on the sheet are numbered #1, #2 ... from top to bottom, then left to right.)
*#10  SDTitleBlock  (value not drawn)  (graphical)
CN?#3  JTAG  [IDC20S]
R?#37  [N/A]  [0603R]  (value not drawn)
R?#38  [N/A]  [0603R]  (value not drawn)
R?#39  [N/A]  [0603R]  (value not drawn)
R?#40  [N/A]  [0603R]  (value not drawn)
R?#41  22  [0603R]
R?#42  22  [0603R]
R?#43  22  [0603R]
R?#44  22  [0603R]
R?#45  22  [0603R]
R?#46  22  [0603R]
R?#47  [N/A]  [0603R]  (value not drawn)
R?#48  [N/A]  [0603R]  (value not drawn)
R?#49  10K  [0603R]
R?#50  10K  [0603R]
R?#51  10K  [0603R]
U?#4  ESDALC6V1W5  [SOT-353]
U?#5  ESDALC6V1W5  [SOT-353]

### Ports
RESET# (bidir), TCK (out), TDI (out), TDO (in), TMS (out), TRST (out)

### Nets
+3V3: CN?#3.1 CN?#3.2 R?#37.2 R?#38.2 R?#39.2 R?#40.2 R?#48.2
GND: CN?#3.4 CN?#3.6 CN?#3.8 CN?#3.10 CN?#3.12 CN?#3.14 CN?#3.16 CN?#3.18 CN?#3.20 R?#47.1 R?#49.1 R?#50.1 R?#51.1 U?#4.2(GND) U?#5.2(GND)
NetCN?#3_3: CN?#3.3 R?#37.1 R?#45.1 U?#4.4(IO3)
NetCN?#3_5: CN?#3.5 R?#38.1 R?#44.1 U?#4.5(IO4)
NetCN?#3_7: CN?#3.7 R?#40.1 R?#41.1 U?#5.1(IO1)
NetCN?#3_9: CN?#3.9 R?#42.1 R?#47.2 U?#5.3(IO2)
NetCN?#3_11: CN?#3.11 R?#48.1 R?#49.2
NetCN?#3_13: CN?#3.13 R?#39.1 R?#43.1 U?#5.4(IO3)
NetCN?#3_15: CN?#3.15 R?#46.1 U?#5.5(IO4)
NetCN?#3_17: CN?#3.17 R?#50.2
NetCN?#3_19: CN?#3.19 R?#51.2
NetR?#41_2: R?#41.2 ; port TMS
NetR?#42_2: R?#42.2 ; port TCK
NetR?#43_2: R?#43.2 ; port TDO
NetR?#44_2: R?#44.2 ; port TDI
NetR?#45_2: R?#45.2 ; port TRST
NetR?#46_2: R?#46.2 ; port RESET#

Not connected (* = marked no-connect by the designer): U?#4 1(IO1) 3(IO2)

### Notes on the sheet
- JTAG
- (near R?#37) DNP
- (near R?#38) DNP
- (near R?#39) DNP
- (near R?#40) DNP
- (near R?#41) PA13
- (near CN?#3) JTAG connector
- (near R?#41) PA14
- (near R?#42) PB3
- (near R?#43) PA15
- (near R?#44) PB4
- (near R?#47) DNP
- (near R?#46) CLOCKS (CPU & PCIE)
- (near R?#48) DNP
- CONFIDENTAL. Do not distribute.
- Variant:
- Checked by
- (in symbol SDTitleBlock) Title:; Page Contents:; Revision:; Size:; DWG NO; Date:; Sheet; of

### Library data of the parts
CN?#3 = 20PIN1
R?#37-R?#51 = Res1: Resistor; Value: 1K; Published: 8-Jun-2000; Revision: July-2002: Re-released for DXP Platform.; Publisher: Altium Limited
U?#4 U?#5 = ESDALC6V1W5: Dual Transil array for ESD protection; Manuf_1: STM; Manuf_Part_1: ESDA5V3L; Ref St: 9179034; Provided: ST; ECCN_US/EU: EAR99/NEC; Distrib: ST; Order: ESDA5V3L; Ordered by: STM

## Sheet [08] - RS232.SchDoc
size A3; DocumentNumber: 8; SheetNumber: 8; SheetTotal: 18
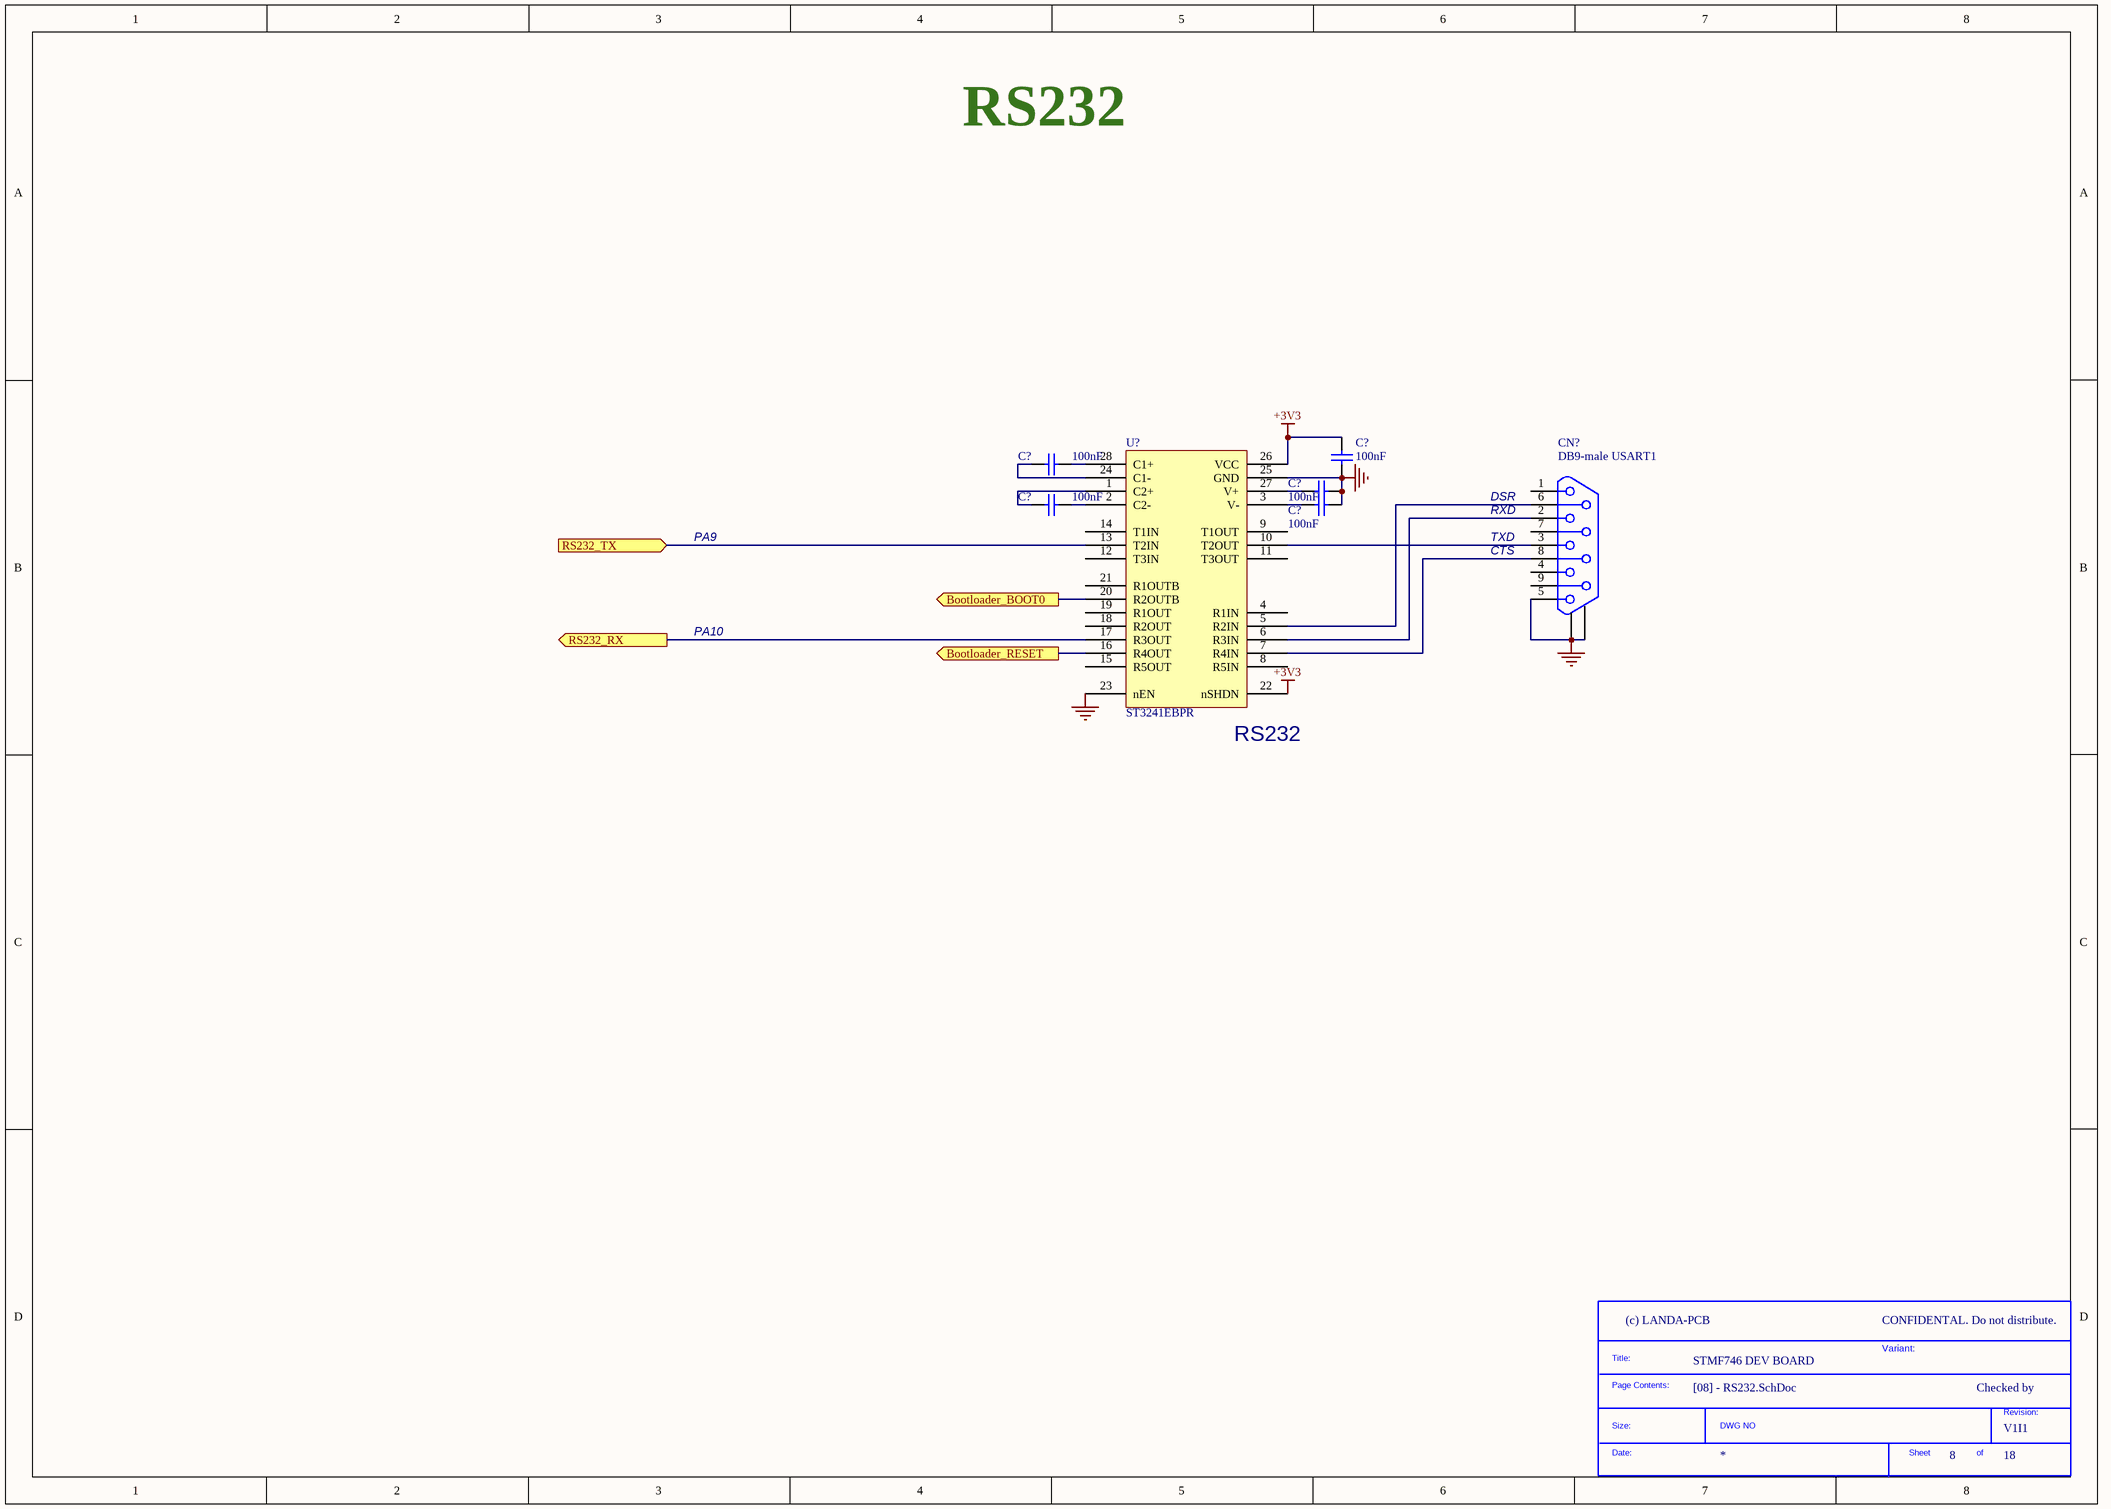
[diagram p10: [08] - RS232.SchDoc]

### Parts
(Parts that share a designator on the sheet are numbered #1, #2 ... from top to bottom, then left to right.)
*#11  SDTitleBlock  (value not drawn)  (graphical)
C?#57  100nF  [0603C]
C?#58  100nF  [0603C]
C?#59  100nF  [0603C]
C?#60  100nF  [0603C]
C?#61  100nF  [0603C]
CN?#4  DB9-male USART1  [DB9/M]
U?#6  ST3241EBPR  [SSOP28_0R65_10R2X7R8]

### Ports
Bootloader_BOOT0 (out), Bootloader_RESET (out), RS232_RX (out), RS232_TX (in)

### Nets
+3V3: C?#58.1 U?#6.22(nSHDN) U?#6.26(VCC)
GND: C?#58.2 C?#60.1 C?#61.1 CN?#4.5 CN?#4.10 CN?#4.11 U?#6.23(nEN) U?#6.25(GND)
NetC?#57_1: C?#57.1 U?#6.24(C1-)
NetC?#57_2: C?#57.2 U?#6.28(C1+)
NetC?#59_1: C?#59.1 U?#6.1(C2+)
NetC?#59_2: C?#59.2 U?#6.2(C2-)
NetC?#60_2: C?#60.2 U?#6.27(V+)
NetC?#61_2: C?#61.2 U?#6.3(V-)
NetCN?#4_2: CN?#4.2 U?#6.6(R3IN)
NetCN?#4_3: CN?#4.3 U?#6.10(T2OUT)
NetCN?#4_6: CN?#4.6 U?#6.5(R2IN)
NetCN?#4_8: CN?#4.8 U?#6.7(R4IN)
NetU?#6_13: U?#6.13(T2IN) ; port RS232_TX
NetU?#6_16: U?#6.16(R4OUT) ; port Bootloader_RESET
NetU?#6_17: U?#6.17(R3OUT) ; port RS232_RX
NetU?#6_20: U?#6.20(R2OUTB) ; port Bootloader_BOOT0

Not connected (* = marked no-connect by the designer): CN?#4 1 4 7 9; U?#6 4(R1IN) 8(R5IN) 9(T1OUT) 11(T3OUT) 12(T3IN) 14(T1IN) 15(R5OUT) 18(R2OUT) 19(R1OUT) 21(R1OUTB)

### Notes on the sheet
- RS232
- (near CN?#4) RXD
- (near CN?#4) DSR
- PA9
- (near CN?#4) TXD
- (near CN?#4) CTS
- PA10
- (near U?#6) RS232
- CONFIDENTAL. Do not distribute.
- CLOCKS (CPU & PCIE)
- Variant:
- Checked by
- (in symbol SDTitleBlock) Title:; Page Contents:; Revision:; Size:; DWG NO; Date:; Sheet; of

### Library data of the parts
C?#57-C?#61 = Cap: Capacitor; Value: 10nF; Published: 8-Jun-2000; Revision: July-2002: Re-released for DXP Platform.; Publisher: Altium Limited
CN?#4 = DB9-USART
U?#6 = ST3241

## Sheet [09] - ETHERNET.SchDoc
size A3; DocumentNumber: 9; SheetNumber: 9; SheetTotal: 18
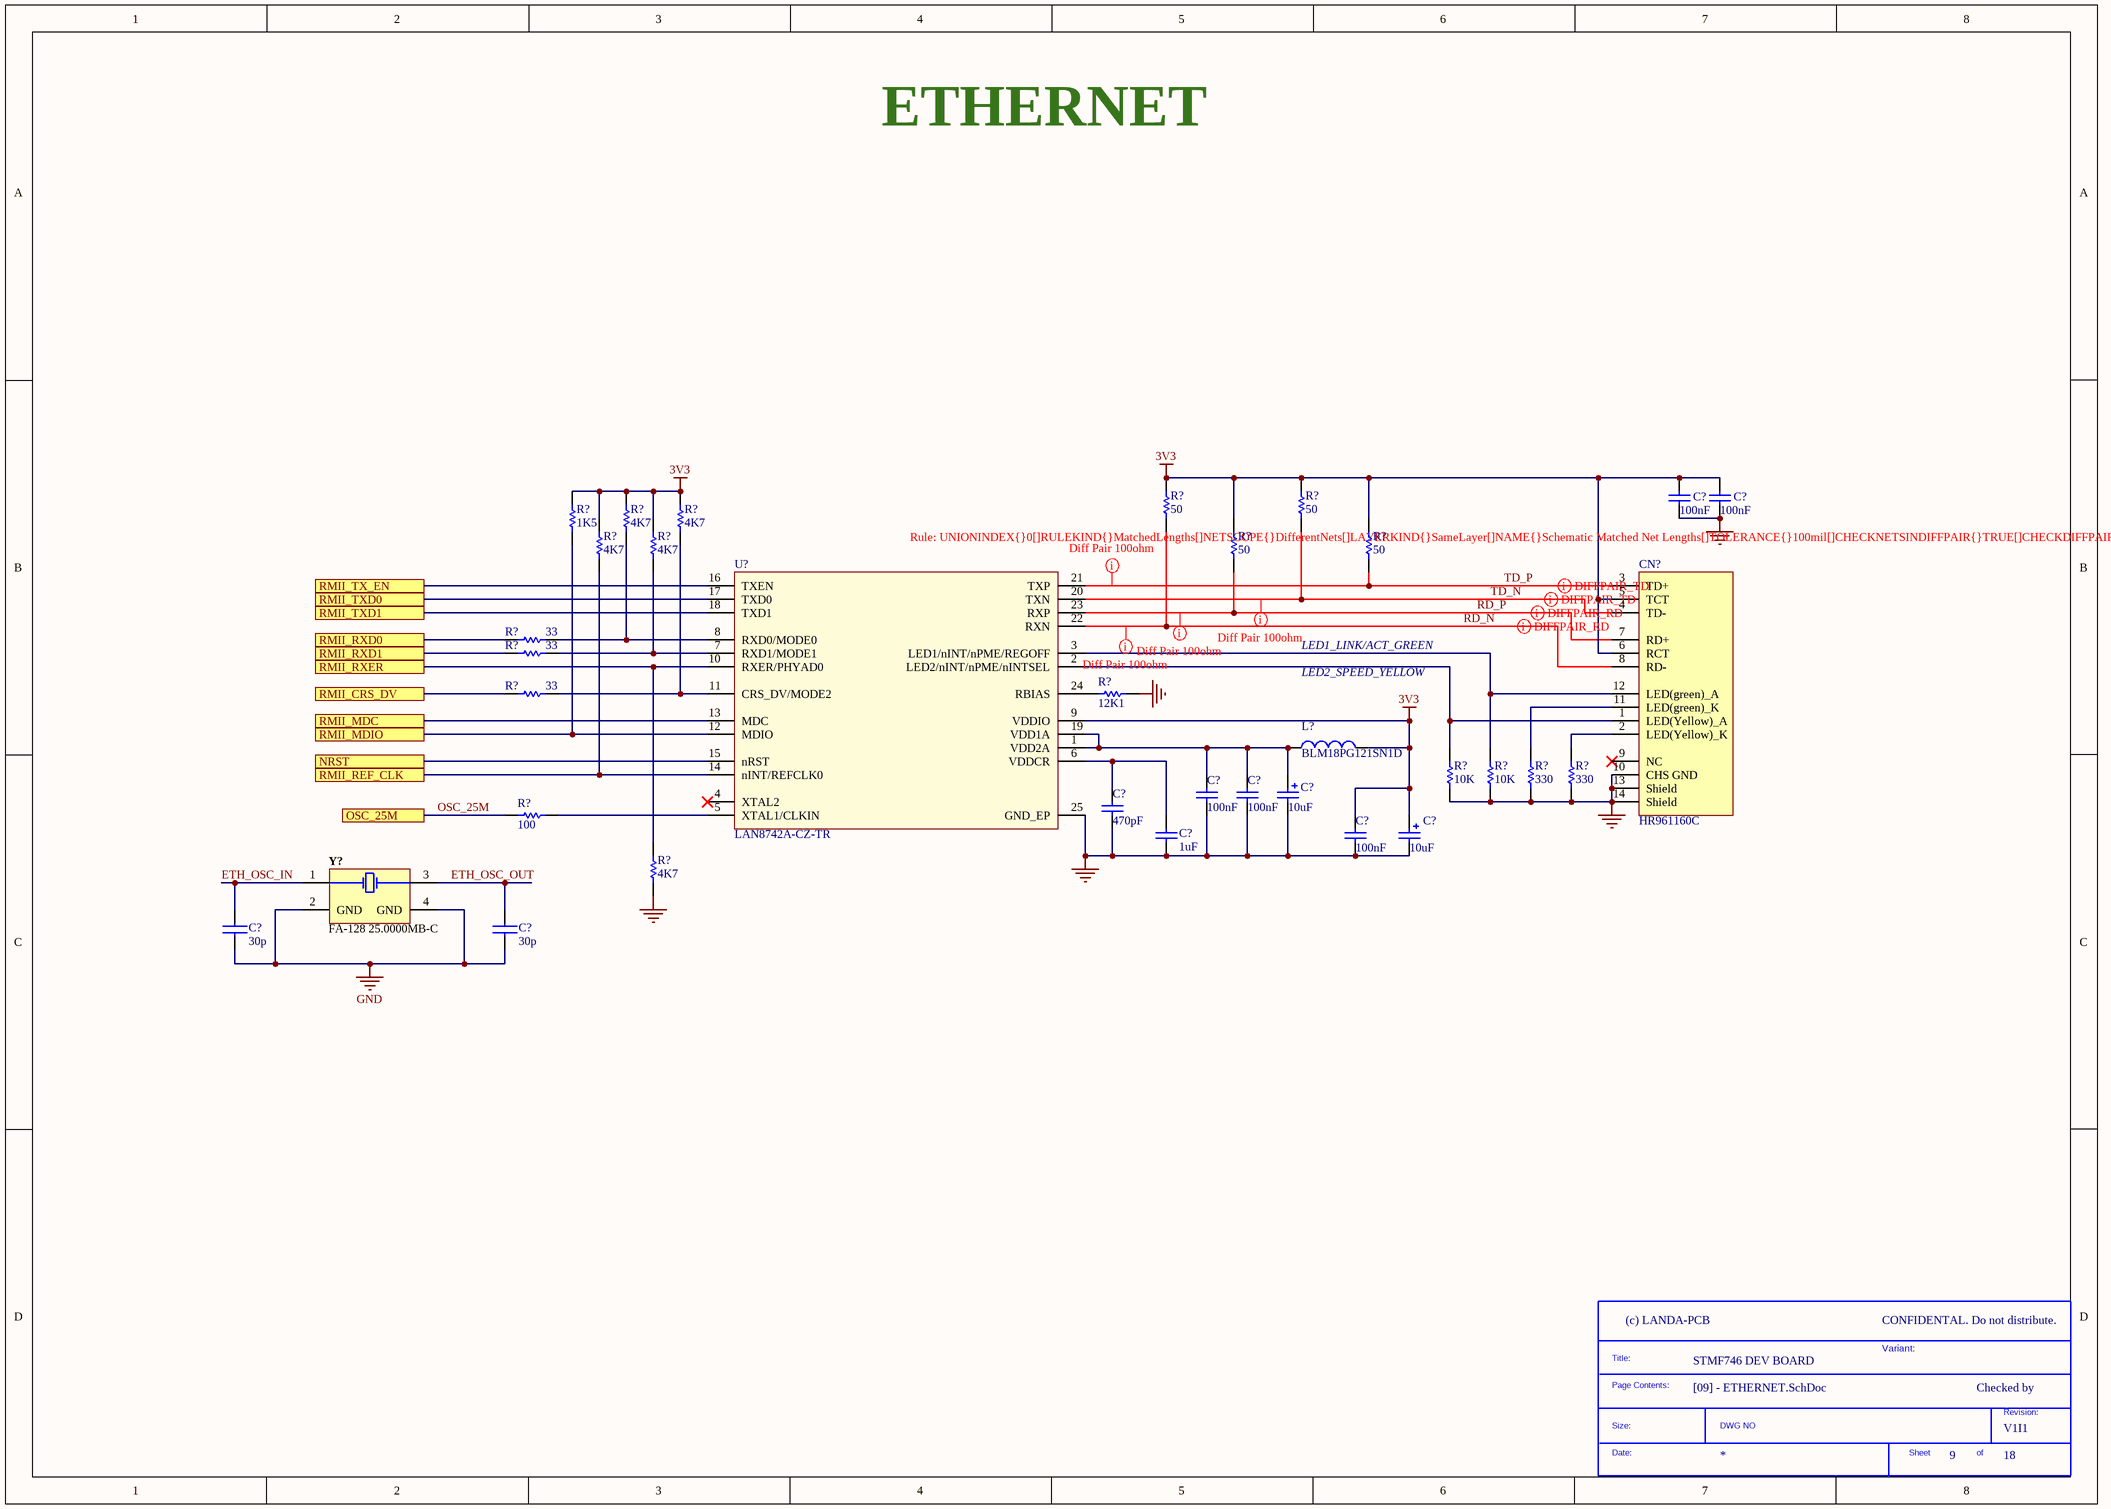
[diagram p11: [09] - ETHERNET.SchDoc]

### Parts
(Parts that share a designator on the sheet are numbered #1, #2 ... from top to bottom, then left to right.)
*#12  SDTitleBlock  (value not drawn)  (graphical)
C?#62  100nF  [0402C]
C?#63  100nF  [0402C]
C?#64  10uF  [TAN-A]
C?#65  100nF  [0402C]
C?#66  100nF  [0402C]
C?#67  470pF  [0402C]
C?#68  10uF  [TAN-A]
C?#69  1uF  [0603C]
C?#70  100nF  [0402C]
C?#71  30p  [C0402]
C?#72  30p  [C0402]
CN?#5  HR961160C  [RJ45_HR961160C]
L?#2  BLM18PG121SN1D  [0603L]
R?#52  50  [0402R]
R?#53  50  [0402R]
R?#54  1K5  [0402R]
R?#55  4K7  [0402R]
R?#56  4K7  [0402R]
R?#57  50  [0402R]
R?#58  50  [0402R]
R?#59  4K7  [0402R]
R?#60  4K7  [0402R]
R?#61  33  [0402R]
R?#62  33  [0402R]
R?#63  12K1  [0603R]
R?#64  33  [0402R]
R?#65  10K  [0402R]
R?#66  10K  [0402R]
R?#67  330  [0402R]
R?#68  330  [0402R]
R?#69  100  [0402R]
R?#70  4K7  [0402R]
U?#7  LAN8742A-CZ-TR  [QFN24_0R5_4X4]
Y?  FA-128 25.0000MB-C  [EPSON-FA-128_V]

### Ports
NRST, OSC_25M, RMII_CRS_DV, RMII_MDC, RMII_MDIO, RMII_REF_CLK, RMII_RXD0, RMII_RXD1, RMII_RXER, RMII_TX_EN, RMII_TXD0, RMII_TXD1

### Nets
3V3: C?#62.2 C?#63.2 C?#68.1 C?#70.2 CN?#5.5(TCT) CN?#5.6(RCT) L?#2.2 R?#52.1 R?#53.1 R?#54.2 R?#55.2 R?#56.2 R?#57.1 R?#58.1 R?#59.2 R?#60.2 U?#7.9(VDDIO)  [project net 3V3_uSD]
GND: C?#62.1 C?#63.1 C?#64.2 C?#65.1 C?#66.1 C?#67.1 C?#68.2 C?#69.1 C?#70.1 C?#71.2 C?#72.2 CN?#5.10(CHS_GND) CN?#5.13(Shield) CN?#5.14(Shield) R?#63.2 R?#65.1 R?#66.1 R?#67.1 R?#68.1 R?#70.1 U?#7.25(GND_EP) Y?.2(GND) Y?.4(GND)
ETH_OSC_IN: C?#71.1 Y?.1(X1)
ETH_OSC_OUT: C?#72.1 Y?.3(X2)
NRST: U?#7.15(nRST) ; port NRST
OSC_25M: R?#69.1 ; port OSC_25M
RD_N: CN?#5.8(RD-) R?#52.2 U?#7.22(RXN)
RD_P: CN?#5.7(RD+) R?#57.2 U?#7.23(RXP)
TD_N: CN?#5.4(TD-) R?#53.2 U?#7.20(TXN)
TD_P: CN?#5.3(TD+) R?#58.2 U?#7.21(TXP)
NetC?#64_1: C?#64.1 C?#65.2 C?#66.2 L?#2.1 U?#7.1(VDD2A) U?#7.19(VDD1A)
NetC?#67_2: C?#67.2 C?#69.2 U?#7.6(VDDCR)
NetCN?#5_1: CN?#5.1(LED(Yellow)_A) R?#65.2 U?#7.2(LED2/nINT/nPME/nINTSEL)
NetCN?#5_2: CN?#5.2(LED(Yellow)_K) R?#68.2
NetCN?#5_11: CN?#5.11(LED(green)_K) R?#67.2
NetCN?#5_12: CN?#5.12(LED(green)_A) R?#66.2 U?#7.3(LED1/nINT/nPME/REGOFF)
NetR?#54_1: R?#54.1 U?#7.12(MDIO) ; port RMII_MDIO
NetR?#55_1: R?#55.1 R?#61.1 U?#7.8(RXD0/MODE0)
NetR?#56_1: R?#56.1 R?#64.1 U?#7.11(CRS_DV/MODE2)
NetR?#59_1: R?#59.1 U?#7.14(nINT/REFCLK0) ; port RMII_REF_CLK
NetR?#60_1: R?#60.1 R?#62.1 U?#7.7(RXD1/MODE1)
NetR?#61_2: R?#61.2 ; port RMII_RXD0
NetR?#62_2: R?#62.2 ; port RMII_RXD1
NetR?#63_1: R?#63.1 U?#7.24(RBIAS)
NetR?#64_2: R?#64.2 ; port RMII_CRS_DV
NetR?#69_2: R?#69.2 U?#7.5(XTAL1/CLKIN)
NetR?#70_2: R?#70.2 U?#7.10(RXER/PHYAD0) ; port RMII_RXER
NetU?#7_13: U?#7.13(MDC) ; port RMII_MDC
NetU?#7_16: U?#7.16(TXEN) ; port RMII_TX_EN
NetU?#7_17: U?#7.17(TXD0) ; port RMII_TXD0
NetU?#7_18: U?#7.18(TXD1) ; port RMII_TXD1

Not connected (* = marked no-connect by the designer): CN?#5 9(NC)*; U?#7 4(XTAL2)*

### Layout directives
differential pair: RD_N, RD_P, TD_N, TD_P
rule Matched Net Lengths [Tolerance = 100mil]: RD_N, RD_P, TD_N, TD_P

### Notes on the sheet
- ETHERNET
- LED1_LINK/ACT_GREEN
- LED2_SPEED_YELLOW
- CONFIDENTAL. Do not distribute.
- CLOCKS (CPU & PCIE)
- Variant:
- Checked by
- (in symbol SDTitleBlock) Title:; Page Contents:; Revision:; Size:; DWG NO; Date:; Sheet; of

### Library data of the parts
C?#62 C?#63 C?#65 C?#66 C?#70 = Cap_100nF_X7R_10%_0402: as C?#42 on sheet [05] - QSPI FLASH; Revision: July-2002: Re-released for DXP Platform.; Value: 100nF; Order: CC0402KRX7R7BB104; Manuf_1: YAGEO
C?#64 C?#68 = Cap_10uF_POL_10%_TANA: Polarized Capacitor,10uF,10V,10%,typeA,VISHAY; Manuf_Part_1: 293D106X9010A2TE3; Revision: July-2002: Re-released for DXP Platform.; Value: 10uF; Manuf_1: VISHAY; Order: *; ECCN_US/EU: n/a
C?#67 = Cap_470pF_X7R_10%_0402: Capacitor,470pF,16V,X7R,10%,0402,YAGEO; Manuf_Part_1: 0402YC471KAT4A; Manuf_1: AVX; Revision: July-2002: Re-released for DXP Platform.; Value: 470pF; Order: 0402YC471KAT4A; ECCN_US/EU: n/a
C?#69 = Cap_1uF_X5R_10%_0603: Capacitor,1uF,16V,X5R,10%,0603,YAGEO; Manuf_Part_1: CC0603KRX5R7BB105; Revision: July-2002: Re-released for DXP Platform.; Value: 1uF; Order: CC0603KRX5R7BB105; Manuf_1: YAGEO; ECCN_US/EU: n/a
C?#71 C?#72 = C1005C0G1H180J: CAP CER 18PF 50V C0G 5% 0402; Manufacturer: TDK Corporation; .Checked PCB: used; Temperature Coefficient: C0G, NP0; Capacitance: 18pF; Category: Capacitors; Supplier Part Number: 445-1238-1-ND; Manufacturer Part Number: C1005C0G1H180J; Operating Temperature: -55°C ~ 125°C; Package / Case: 0402 (1005 Metric); Price 1k [$]: 0.00468; Value: 18pF; .Checked SCH: used; Voltage - Rated: 50V; Supplier: Digikey; Supplier 1: Digi-Key; Supplier Part Number 1: 445-1238-1-ND; RoHS: RoHS Compliant; Stock 1: 24321; Pricing 1: 1=0.08, 10=0.05, 100=0.018, 250=0.013, 500=0.0096, 1000=0.0065 (USD); Tolerance: ±5%; Mounting Type: Surface Mount, MLCC; Applications: General Purpose; Ratings: -; Size / Dimension: 0.039" L x 0.020" W (1.00mm x 0.50mm); Height - Seated (Max): -; Thickness (Max): 0.022" (0.55mm); Lead Spacing: -; Features: -; Packaging: Cut Tape (CT); Lead Style: -; ComponentLink1URL: http://www.tdk.co.jp/tefe02/e412_c.pdf; ComponentLink1Description: http://www.tdk.co.jp/tefe02/e412_c.pdf
CN?#5 = HR961160C: 100 Base-TX (Fast Ethernet) SMD RJ45 single port (1x1) with LEDS Integrated Magnetics Connector; Manuf_1: HanRun; Manuf_2: Pulse Electronics Corporation; Manuf_Part_2: J3011G21DNLT; Manuf_3: K.O.D International Holding; Manuf_Part_3: RMT-119A-12F6-GY-04; Distrib: Sub Co; Manuf_Part_1: HR961160C; Order: *
L?#2 = BEAD_120R_2A_0603: Bead,120R,2A,0603,BLM18PG121SN1D,MURATA; Manuf_Part_3: FCM1608KF-601T03; Manuf_2: TDK; Manuf_Part_2: MPZ1608S300A; Manuf_3: Tai-tech; Value: 100uH; Description_3: Bead,600R,350mA,0603,FCM1608KF-601T03,Tai-tech; Description_2: Bead,30R,5A,0603,MPZ1608S300A,TDK; Revision: July-2002: Re-released for DXP Platform.; ECCN_US/EU: n/a; Manuf_Part_1: BLM18PG121SN1D; Manuf_1: MURATA
R?#52 R?#53 R?#57 R?#58 = Res_50_1%_0402: Resistor,50,0402,1%,YAGEO; Manuf_Part_1: RC0402FR-0749R9L; Value: 49.9; Manuf_1: YAGEO; Order: *; ECCN_US/EU: n/a; Distrib: FARNELL
R?#54 = Res_1K5_1%_0402: Resistor,1K5,0402,1%,YAGEO; Manuf_Part_1: RC0402FR-071K5L; Value: 1K5; Manuf_1: YAGEO; Order: RC0402FR-071K5L; ECCN_US/EU: n/a; Distrib: FARNELL
R?#55 R?#56 R?#59 R?#60 R?#70 = Res_4K7_1%_0402: Resistor,4K7,0402,1%,YAGEO; Manuf_Part_1: RT0402FRE074K7L; Value: 4K7; Manuf_1: YAGEO; Order: RT0402FRE074K7L; ECCN_US/EU: n/a
R?#61 R?#62 R?#64 = Res_33_1%_0402: Resistor,33,0402,1%,YAGEO; Manuf_Part_1: RC0402FR-0733RL; Value: 33; Manuf_1: YAGEO; Order: *; ECCN_US/EU: n/a; Distrib: FARNELL
R?#63 = Res_12K1_1%_0603: Resistor,12K1,0603,1%,VISHAY; Manuf_Part_1: MCT 0603-50 1% P5 12K1; Order: 2325243; Value: 12K1; ECCN_US/EU: n/a; Manuf_1: VISHAY; Distrib: FARNELL
R?#65 R?#66 = Res_10K_1%_0402: as R?#21 on sheet [05] - QSPI FLASH; Value: 10K; Manuf_1: YAGEO; Order: RC0402FR-0710KL; ECCN_US/EU: n/a
R?#67 R?#68 = Res_330_1%_0402: Resistor,330,0402,1%,YAGEO; Manuf_Part_1: RC0402FR-07330RL; Value: 330; ECCN_US/EU: n/a; Manuf_1: YAGEO; Distrib: DIGIKEY; Order: RC0402FR-07330RL
R?#69 = Res_100_1%_0402: Resistor,100,0402,1%,YAGEO; Manuf_Part_1: RC0402FR-07100RL; Order: 9239111; Value: 100; Manuf_1: YAGEO; ECCN_US/EU: n/a; Distrib: FARNELL
U?#7 = LAN8742A-CZ-TR: LAN8742A-CZ-TR - Small Footprint RMII 10/100 Ethernet, Transceiver with HP Auto-MDIX and flexPWR Technology SQFN-24; Manuf_1: MICROCHIP; Order: LAN8742A-CZ-TR; Manuf_Part_1: LAN8742A-CZ-TR; Distrib: MICROCHIP
Y? = CMP-1695-00001-3: Range Crystal Unit, 25 MHz, -40 to 85 degC, 4-Pin SMD, RoHS, Tape and Reel; ComponentLink2Description: Datasheet; Mounting Technology: Surface Mount; PackageDescription: 4-Pin Surface Mount Device, Body 1.6 x 2 mm, Pitch 1.45 mm; ComponentLink1URL: https://www.eea.epson.com/; DatasheetVersion: Rev. Feb-15; ComponentLink2URL: https://support.epson.biz/td/api/doc_check.php?dl=brief_FA-128_en.pdf; ComponentLink1Description: Manufacturer URL; PartNumber: FA-128 25.0000MB-C

## Sheet [10] - USB.SchDoc
size A3; DocumentNumber: 10; SheetNumber: 10; SheetTotal: 18
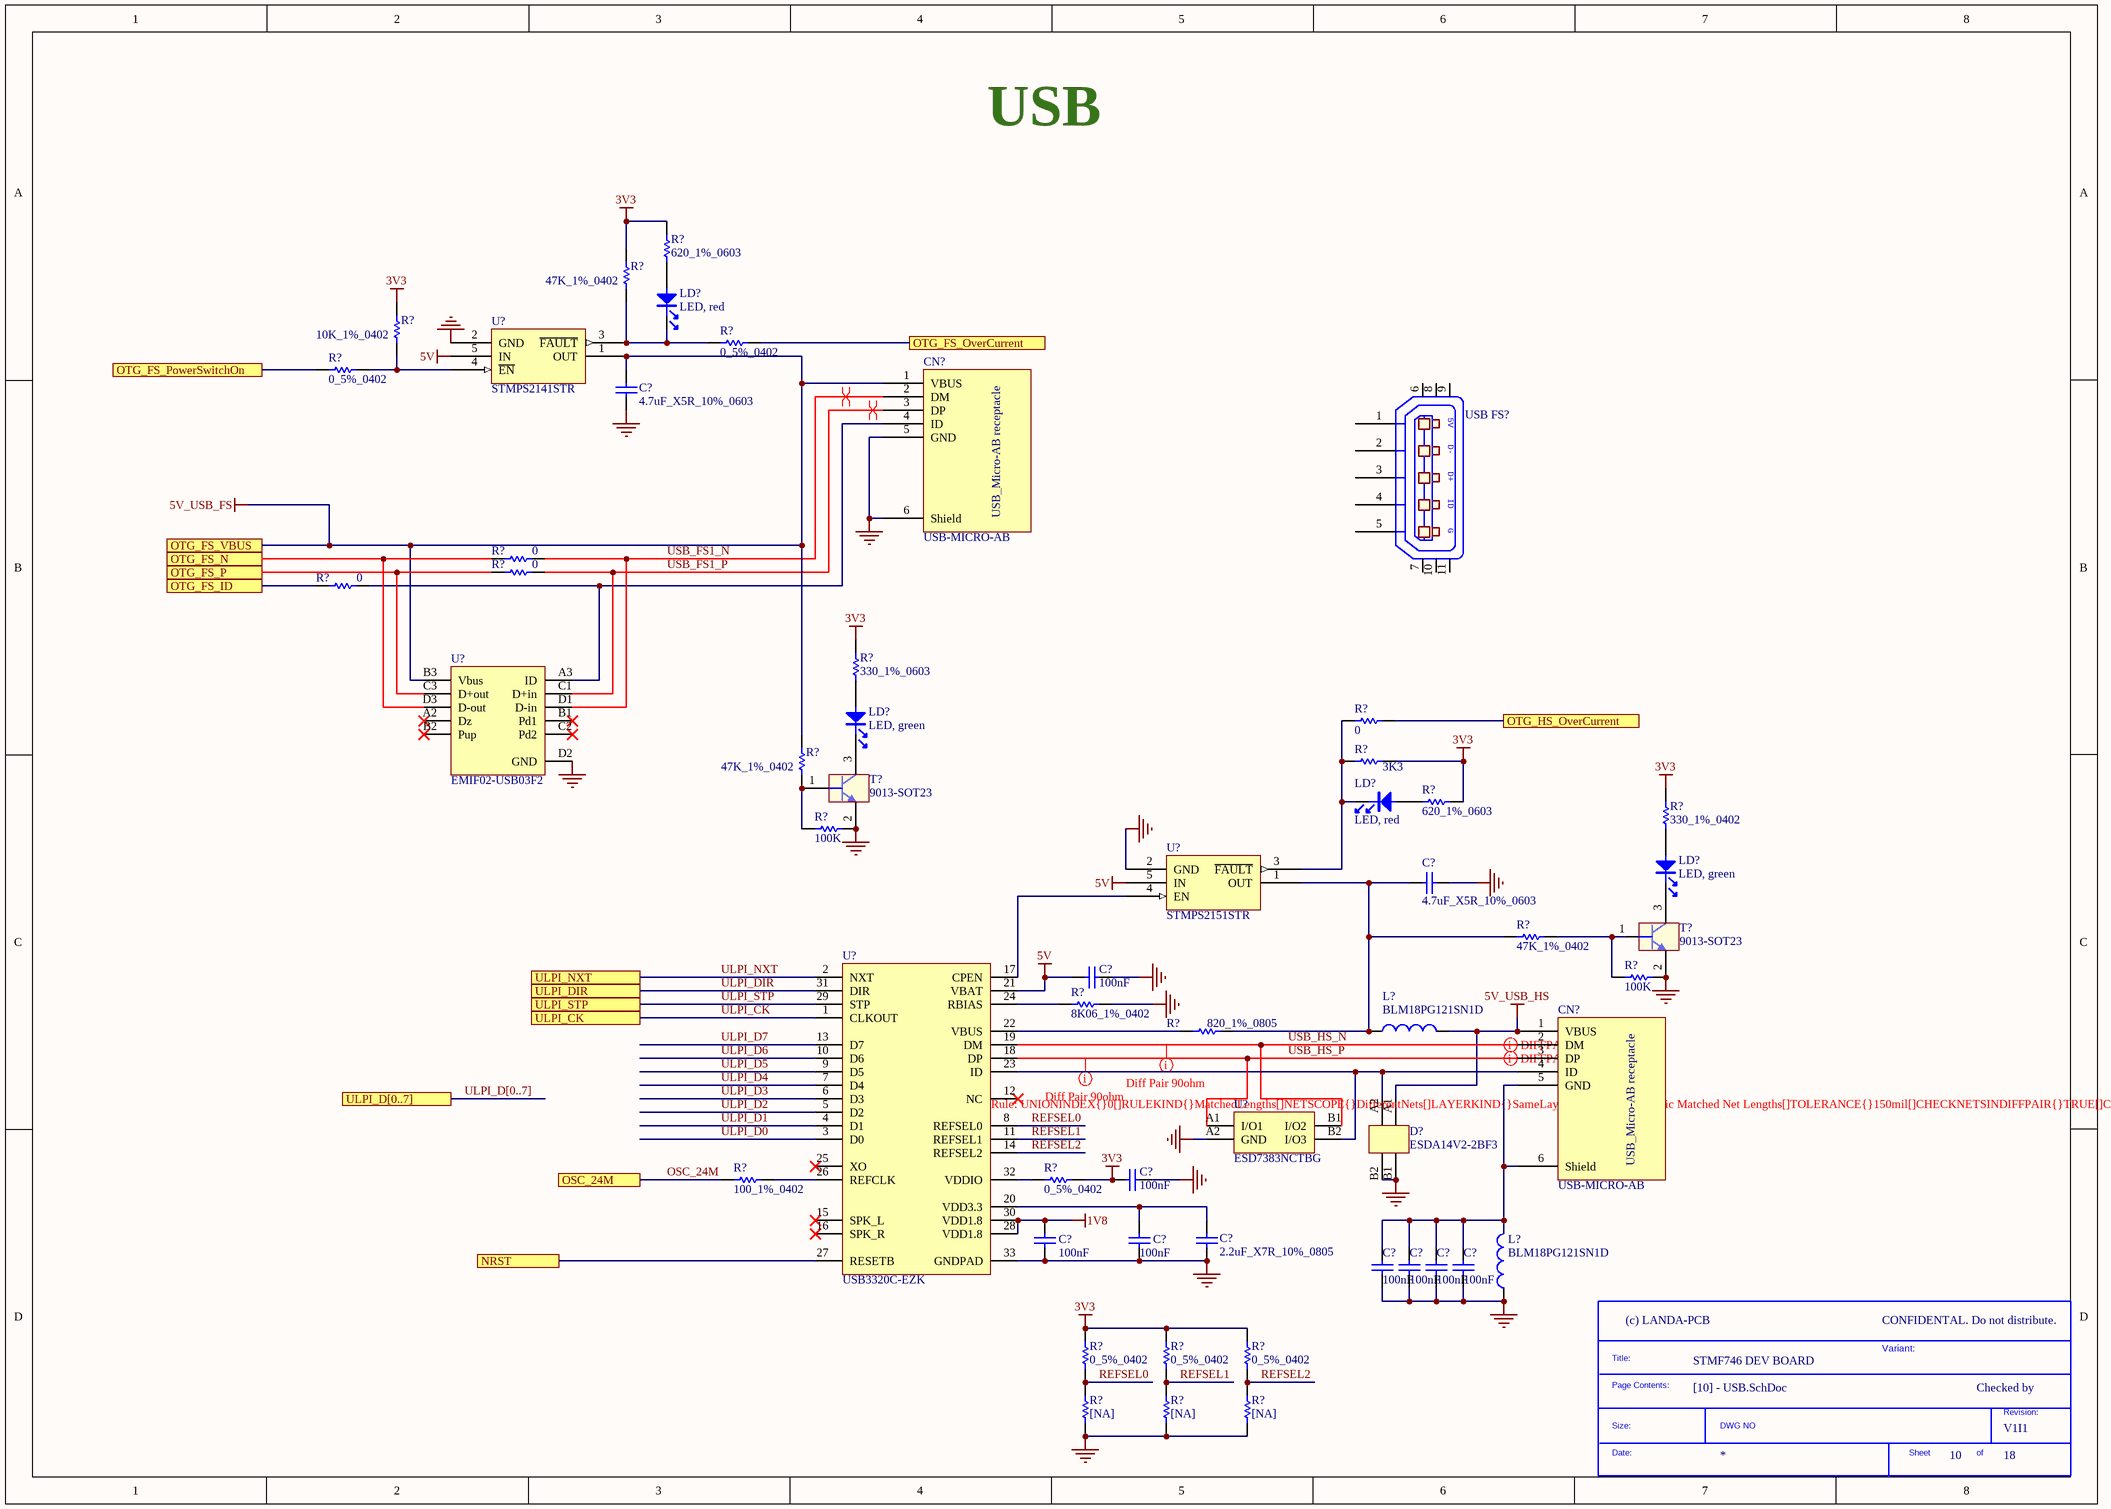
[diagram p12: [10] - USB.SchDoc]

### Parts
(Parts that share a designator on the sheet are numbered #1, #2 ... from top to bottom, then left to right.)
*#13  SDTitleBlock  (value not drawn)  (graphical)
C?#73  4.7uF_X5R_10%_0603  [0603C]
C?#74  4.7uF_X5R_10%_0603  [0603C]
C?#75  100nF  [0402C]
C?#76  100nF  [0402C]
C?#77  100nF  [0402C]
C?#78  100nF  [0402C]
C?#79  2.2uF_X7R_10%_0805  [0805C]
C?#80  100nF  [0402C]
C?#81  100nF  [0402C]
C?#82  100nF  [0402C]
C?#83  100nF  [0402C]
CN?#6  USB-MICRO-AB  [USB-MICRO-AB]
CN?#7  USB-MICRO-AB  [USB-MICRO-AB]
D?#1  ESDA14V2-2BF3  [BGA4_1X1]
L?#3  BLM18PG121SN1D  [0603L]
L?#4  BLM18PG121SN1D  [0603L]
LD?#1  LED, red  [0603D]
LD?#2  LED, green  [0603D]
LD?#3  LED, red  [0603D]
LD?#4  LED, green  [0603D]
R?#71  620_1%_0603  [0603R]
R?#72  47K_1%_0402  [0402R]
R?#73  0_5%_0402  [0402R]
R?#74  10K_1%_0402  [0402R]
R?#75  0_5%_0402  [0402R]
R?#76  0  [0402R]
R?#77  0  [0402R]
R?#78  0  [0402R]
R?#79  330_1%_0603  [0603R]
R?#80  0  [0402R]
R?#81  47K_1%_0402  [0402R]
R?#82  3K3  [0402R]
R?#83  620_1%_0603  [0603R]
R?#84  100K  [0402R]
R?#85  330_1%_0402  [0402R]
R?#86  47K_1%_0402  [0402R]
R?#87  100K  [0402R]
R?#88  8K06_1%_0402  [0402R]
R?#89  820_1%_0805  [0805R]
R?#90  100_1%_0402  [0402R]
R?#91  0_5%_0402  [0402R]
R?#92  0_5%_0402  [0402R]
R?#93  0_5%_0402  [0402R]
R?#94  0_5%_0402  [0402R]
R?#95  [NA]  [0402R]
R?#96  [NA]  [0402R]
R?#97  [NA]  [0402R]
T?#1  9013-SOT23  [SOT23]
T?#2  9013-SOT23  [SOT23]
U?#8  STMPS2141STR  [SOT23-5L]
U?#9  EMIF02-USB03F2  [Flip Chip]
U?#10  STMPS2151STR  [SOT23-5L]
U?#11  USB3320C-EZK  [QFN32_0R5_5X5]
U?#12  ESD7383NCTBG  [ESD_WLCSP4_CASE-567CB_0P80X0P80_P040]
USB_FS?  USB MICRO AB  [USB_Micro_AB]  (value not drawn)

### Ports
NRST, OSC_24M, OTG_FS_ID, OTG_FS_N, OTG_FS_OverCurrent, OTG_FS_P, OTG_FS_PowerSwitchOn, OTG_FS_VBUS, OTG_HS_OverCurrent, ULPI_CK, ULPI_D[0..7], ULPI_DIR, ULPI_NXT, ULPI_STP

### Nets
1V8: C?#77.2 U?#11.28(VDD1.8) U?#11.30(VDD1.8)
3V3: C?#76.1 R?#71.2 R?#72.2 R?#74.2 R?#79.2 R?#82.1 R?#83.2 R?#85.2 R?#91.2 R?#92.2 R?#93.2 R?#94.2  [project net 3V3_uSD]
5V: C?#75.1 U?#8.5(IN) U?#10.5(IN) U?#11.21(VBAT)
5V_USB_FS: C?#73.2 CN?#6.1(VBUS) R?#81.2 U?#8.1(OUT) U?#9.B3(Vbus) ; port OTG_FS_VBUS
5V_USB_HS: CN?#7.1(VBUS) D?#1.A1 L?#3.2
GND: C?#73.1 C?#74.2 C?#75.2 C?#76.2 C?#77.1 C?#78.1 C?#79.1 C?#80.1 C?#81.1 C?#82.1 C?#83.1 CN?#6.5(GND) CN?#6.6(Shield) D?#1.B1 D?#1.B2 L?#4.1 R?#84.2 R?#87.2 R?#88.2 R?#95.1 R?#96.1 R?#97.1 T?#1.2(E) T?#2.2(E) U?#8.2(GND) U?#9.D2(GND) U?#10.2(GND) U?#11.33(GNDPAD) U?#12.A2(GND)
NRST: U?#11.27(RESETB) ; port NRST
OSC_24M: R?#90.1 ; port OSC_24M
REFSEL0: R?#92.1 R?#95.2 U?#11.8(REFSEL0)
REFSEL1: R?#93.1 R?#96.2 U?#11.11(REFSEL1)
REFSEL2: R?#94.1 R?#97.2 U?#11.14(REFSEL2)
ULPI_CK: U?#11.1(CLKOUT) ; port ULPI_CK
ULPI_D0: U?#11.3(D0)
ULPI_D1: U?#11.4(D1)
ULPI_D2: U?#11.5(D2)
ULPI_D3: U?#11.6(D3)
ULPI_D4: U?#11.7(D4)
ULPI_D5: U?#11.9(D5)
ULPI_D6: U?#11.10(D6)
ULPI_D7: U?#11.13(D7)
ULPI_DIR: U?#11.31(DIR) ; port ULPI_DIR
ULPI_NXT: U?#11.2(NXT) ; port ULPI_NXT
ULPI_STP: U?#11.29(STP) ; port ULPI_STP
USB_FS1_N: CN?#6.2(DM) R?#76.2 U?#9.D1(D-in)
USB_FS1_P: CN?#6.3(DP) R?#77.2 U?#9.C1(D+in)
USB_HS_N: CN?#7.2(DM) U?#11.19(DM) U?#12.B1(I/O2)
USB_HS_P: CN?#7.3(DP) U?#11.18(DP) U?#12.A1(I/O1)
NetC?#74_1: C?#74.1 L?#3.1 R?#86.1 R?#89.2 U?#10.1(OUT)
NetC?#78_2: C?#78.2 C?#79.2 U?#11.20(VDD3.3)
NetC?#80_2: C?#80.2 C?#81.2 C?#82.2 C?#83.2 CN?#7.5(GND) CN?#7.6(Shield) L?#4.2
NetCN?#6_4: CN?#6.4(ID) R?#78.2 U?#9.A3(ID)
NetCN?#7_4: CN?#7.4(ID) D?#1.A2 U?#11.23(ID) U?#12.B2(I/O3)
NetLD?#1_1: LD?#1.1 R?#71.1
NetLD?#1_2: LD?#1.2 R?#72.1 R?#73.1 U?#8.3(~{FAULT})
NetLD?#2_1: LD?#2.1 R?#79.1
NetLD?#2_2: LD?#2.2 T?#1.3(C)
NetLD?#3_1: LD?#3.1 R?#83.1
NetLD?#3_2: LD?#3.2 R?#80.1 R?#82.2 U?#10.3(~{FAULT})
NetLD?#4_1: LD?#4.1 R?#85.1
NetLD?#4_2: LD?#4.2 T?#2.3(C)
NetR?#73_2: R?#73.2 ; port OTG_FS_OverCurrent
NetR?#74_1: R?#74.1 R?#75.2 U?#8.4(~{EN})
NetR?#75_1: R?#75.1 ; port OTG_FS_PowerSwitchOn
NetR?#76_1: R?#76.1 U?#9.D3(D-out) ; port OTG_FS_N
NetR?#77_1: R?#77.1 U?#9.C3(D+out) ; port OTG_FS_P
NetR?#78_1: R?#78.1 ; port OTG_FS_ID
NetR?#80_2: R?#80.2 ; port OTG_HS_OverCurrent
NetR?#81_1: R?#81.1 R?#84.1 T?#1.1(B)
NetR?#86_2: R?#86.2 R?#87.1 T?#2.1(B)
NetR?#88_1: R?#88.1 U?#11.24(RBIAS)
NetR?#89_1: R?#89.1 U?#11.22(VBUS)
NetR?#90_2: R?#90.2 U?#11.26(REFCLK)
NetR?#91_1: R?#91.1 U?#11.32(VDDIO)
NetU?#10_4: U?#10.4(EN) U?#11.17(CPEN)

Not connected (* = marked no-connect by the designer): U?#9 A2(Dz)* B1(Pd1)* B2(Pup)* C2(Pd2)*; U?#11 12(NC)* 15(SPK_L)* 16(SPK_R)* 25(XO)*; USB_FS? 1(P1) 2(P2) 3(P3) 4(P4) 5(P5) 6 7 8 9 10 11

### Buses and harness runs
bus ULPI_D[0..7] = port ULPI_D[0..7]

### Layout directives
differential pair: USB_FS1_N, USB_FS1_P, USB_HS_N, USB_HS_P
rule Matched Net Lengths [Tolerance = 150mil]: USB_HS_N, USB_HS_P

### Notes on the sheet
- USB
- CONFIDENTAL. Do not distribute.
- CLOCKS (CPU & PCIE)
- Variant:
- Checked by
- (in symbol 0475890001) 5V; D-; D+; ID; G
- (in symbol SDTitleBlock) Title:; Page Contents:; Revision:; Size:; DWG NO; Date:; Sheet; of
- (in symbol USB-MICRO-AB) USB_Micro-AB receptacle

### Library data of the parts
C?#73 C?#74 = Cap_4.7uF_X5R_10%_0603: Capacitor,4.7uF,16V, X5R,10%,0603,YAGEO; Manuf_Part_1: CC0603KRX5R7BB475; Order: CC0603KRX5R7BB105; Revision: July-2002: Re-released for DXP Platform.; Value: 4.7uF; Manuf_1: YAGEO; ECCN_US/EU: n/a
C?#75-C?#78 C?#80-C?#83 = Cap_100nF_X7R_10%_0402: as C?#42 on sheet [05] - QSPI FLASH; Revision: July-2002: Re-released for DXP Platform.; Value: 100nF; Order: CC0402KRX7R7BB104; Manuf_1: YAGEO
C?#79 = Cap_2.2uF_X7R_10%_0805: Capacitor,2.2uF,16V, X7R,10%,0805,YAGEO; Manuf_Part_1: CC0805KKX7R7BB225; Revision: July-2002: Re-released for DXP Platform.; Value: 2.2uF; Order: CC0805KKX7R7BB225; Manuf_1: YAGEO; ECCN_US/EU: n/a
CN?#6 CN?#7 = USB-MICRO-AB: USB-MICRO-AB, 47590-0001, SMT, MOLEX; Ref St: xxxxxxx; Manuf_1: MOLEX; Manuf_Part_1: 47590-0001; ECCN_US/EU: n/a; Distrib: *
D?#1 = ESDA14V2-2BF3: Quad bidirectional Transil array for ESD protection; Manuf_1: STM; ECCN_US/EU: EAR99/NEC; Provided: ST; Ref St: 9179040; Distrib: ST; Manuf_Part_1: ESDA14V2-2BF3
L?#3 L?#4 = BEAD_120R_2A_0603: as L?#2 on sheet [09] - ETHERNET; Revision: July-2002: Re-released for DXP Platform.; ECCN_US/EU: n/a; Manuf_Part_1: BLM18PG121SN1D; Manuf_1: MURATA
LD?#1 LD?#3 = LED_red: LED, red, 0603; Manuf_1: everlight; Manuf_Part_1: 19-217/R6C-AL1M2VY/3T; ECCN_US/EU: EAR99/NEC; Order: 19-217/R6C-AL1M2VY/3T
LD?#2 LD?#4 = LED_green: LED, green, 0603; Manuf_1: everlight; Manuf_Part_1: 19-213SYGC/S530-E2/TR8; ECCN_US/EU: EAR99/NEC; Order: 19-213SYGC/S530-E2/TR8
R?#71 R?#83 = Res_620_1%_0603: Resistor,620,0603,1%,VISHAY; Manuf_Part_1: CRCW0603620RFKEA; Manuf_1: VISHAY DRALORIC; Value: 620; Order: 2122341; ECCN_US/EU: n/a; Distrib: FARNELL
R?#72 R?#81 R?#86 = Res_47K_1%_0402: as R?#22 on sheet [06] - SD CARD; Value: 47K; Manuf_1: YAGEO; ECCN_US/EU: n/a; Distrib: FARNELL
R?#73 R?#75 R?#91-R?#94 = Res_0_5%_0402: Resistor,0,0402,5%,YAGEO; Manuf_Part_1: RC0402JR-070RL; Value: 0; Order: 2363467; ECCN_US/EU: n/a; Manuf_1: YAGEO; Distrib: FARNELL
R?#74 = Res_10K_1%_0402: as R?#21 on sheet [05] - QSPI FLASH; Value: 10K; Manuf_1: YAGEO; Order: RC0402FR-0710KL; ECCN_US/EU: n/a
R?#76-R?#78 R?#80 = Res_0_5%_0402: Resistor,0,0402,5%,YAGEO; Manuf_Part_1: RC0402JR-070RL; Order: 2363467; Value: 0; ECCN_US/EU: n/a; Manuf_1: YAGEO; Distrib: FARNELL
R?#79 = Res_330_1%_0603: Resistor,330,0603,1%,YAGEO; Manuf_Part_1: RT0603FRE07330RL; Value: 330; Order: 1500622RL; ECCN_US/EU: n/a; Manuf_1: YAGEO; Distrib: FARNELL
R?#82 = Res_3K3_1%_0402: Resistor,3K3,0402,1%,YAGEO; Manuf_Part_1: RC0402FR-073K3L; Value: 3K3; Manuf_1: YAGEO; Order: *; ECCN_US/EU: n/a; Distrib: FARNELL
R?#84 R?#87 = Res_100K_1%_0402: Resistor,100K,0402,1%,YAGEO; Manuf_Part_1: RT0402FRE07100KL; Value: 100K; Manuf_1: YAGEO; Order: RT0402FRE07100KL; ECCN_US/EU: n/a
R?#85 = Res_330_1%_0402: Resistor,330,0402,1%,YAGEO; Manuf_Part_1: RC0402FR-07330RL; Value: 330; ECCN_US/EU: n/a; Manuf_1: YAGEO; Distrib: DIGIKEY; Order: RC0402FR-07330RL
R?#88 = Res_8K06_1%_0402: Resistor,8K06,0402,1%,YAGEO; Manuf_Part_1: RC0402FR-078K06L; Value: 8K06; Manuf_1: YAGEO; Order: RC0402FR-078K06L; ECCN_US/EU: n/a; Distrib: DIGIKEY
R?#89 = Res_820_1%_0805: Resistor,820,0805,1%,YAGEO; Manuf_Part_1: RC0805FR-07820RL; Value: 820; Manuf_1: YAGEO; Order: RC0805FR-07820RL; ECCN_US/EU: n/a
R?#90 = Res_100_1%_0402: Resistor,100,0402,1%,YAGEO; Manuf_Part_1: RC0402FR-07100RL; Value: 100; Order: 9239111; Manuf_1: YAGEO; ECCN_US/EU: n/a; Distrib: FARNELL
R?#95-R?#97 = Res_NA_0402: Resistor,[NA],0402; Fitted: NO; Value: [NA]; ECCN_US/EU: n/a
T?#1 T?#2 = 9013-SOT23: NPN Bipolar Transistor; Manuf_1: NXP; Manuf_Part_1: BSR14; Order: 1081310; ECCN_US/EU: EAR99/NEC; Revision: July-2002: Re-released for DXP Platform.; Distrib: FARNELL
U?#8 = STMPS2141STR: Enhanced single channel power switches; Manuf_1: STM; Provided: ST; ECCN_US/EU: EAR99/NEC; Ref St: 9159003; Order: STMPS2141STR; Manuf_Part_1: STMPS2141STR; Distrib: ST
U?#9 = EMIF02-USB03F2: 2-line IPAD, EMI filter including ESD protection; Manuf_1: STM; Provided: ST; ECCN_US/EU: EAR99/NEC; Ref St: 9179037; Order: EMIF02-USB03F2; Manuf_Part_1: EMIF02-USB03F2; Distrib: ST
U?#10 = STMPS2151STR: Enhanced single channel power switches; Manuf_1: STM; Provided: ST; ECCN_US/EU: EAR99/NEC; Ref St: xxxxxx; Order: STMPS2151STR; Manuf_Part_1: STMPS2151STR; Distrib: ST
U?#11 = USB3320C-EZK: USB3320C,  Hi-Speed USB Host, Device or OTG PHY with ULPI Low Pin Interface; Manuf_1: MICROCHIP; Manuf_Part_1: USB3320C-EZK-TR; Distrib: MICROCHIP; Order: USB3320C-EZK-TR; ECCN_US/EU: *
U?#12 = ESD7383NCTBG: 3-line low capacitance protection for high speed USB; Manuf_1: ON SEMICONDUCTOR; ECCN_US/EU: EAR99/NEC; provided: SUBCO; Manuf_Part_1: ESD7383NCTBG; value: ESD7383NCTBG
USB_FS? = 0475890001: CONN RCPT MICRO USB AB R/A SMD; Manufacturer: Molex Inc; Connector Type: USB - micro AB; Number of Contacts: 5; Gender: Receptacle; .Creator: MM; Supplier 1: Digi-Key; Manufacturer Part Number: 0475890001; RoHS: RoHS Compliant; Category: Connectors, Interconnects; Stock 1: 12754; Pricing 1: 1=0.81, 10=0.764, 25=0.6872, 50=0.6108, 100=0.5854, 250=0.53452, 500=0.50908 (USD); Packaging: Cut Tape (CT); Specifications: -; Mounting Type: Surface Mount, Right Angle, Horizontal; Features: Board Guide, Shielded; Ingress Protection: -; ComponentLink1URL: http://www.molex.com/pdm_docs/sd/475890001_sd.pdf; ComponentLink1Description: http://www.molex.com/pdm_docs/sd/475890001_sd.pdf; Supplier Part Number 1: WM17143CT-ND; .Checked PCB: MM; .Checked SCH: MM